# Altium project parallella_schematic.PrjPcb (part 1 of 3)
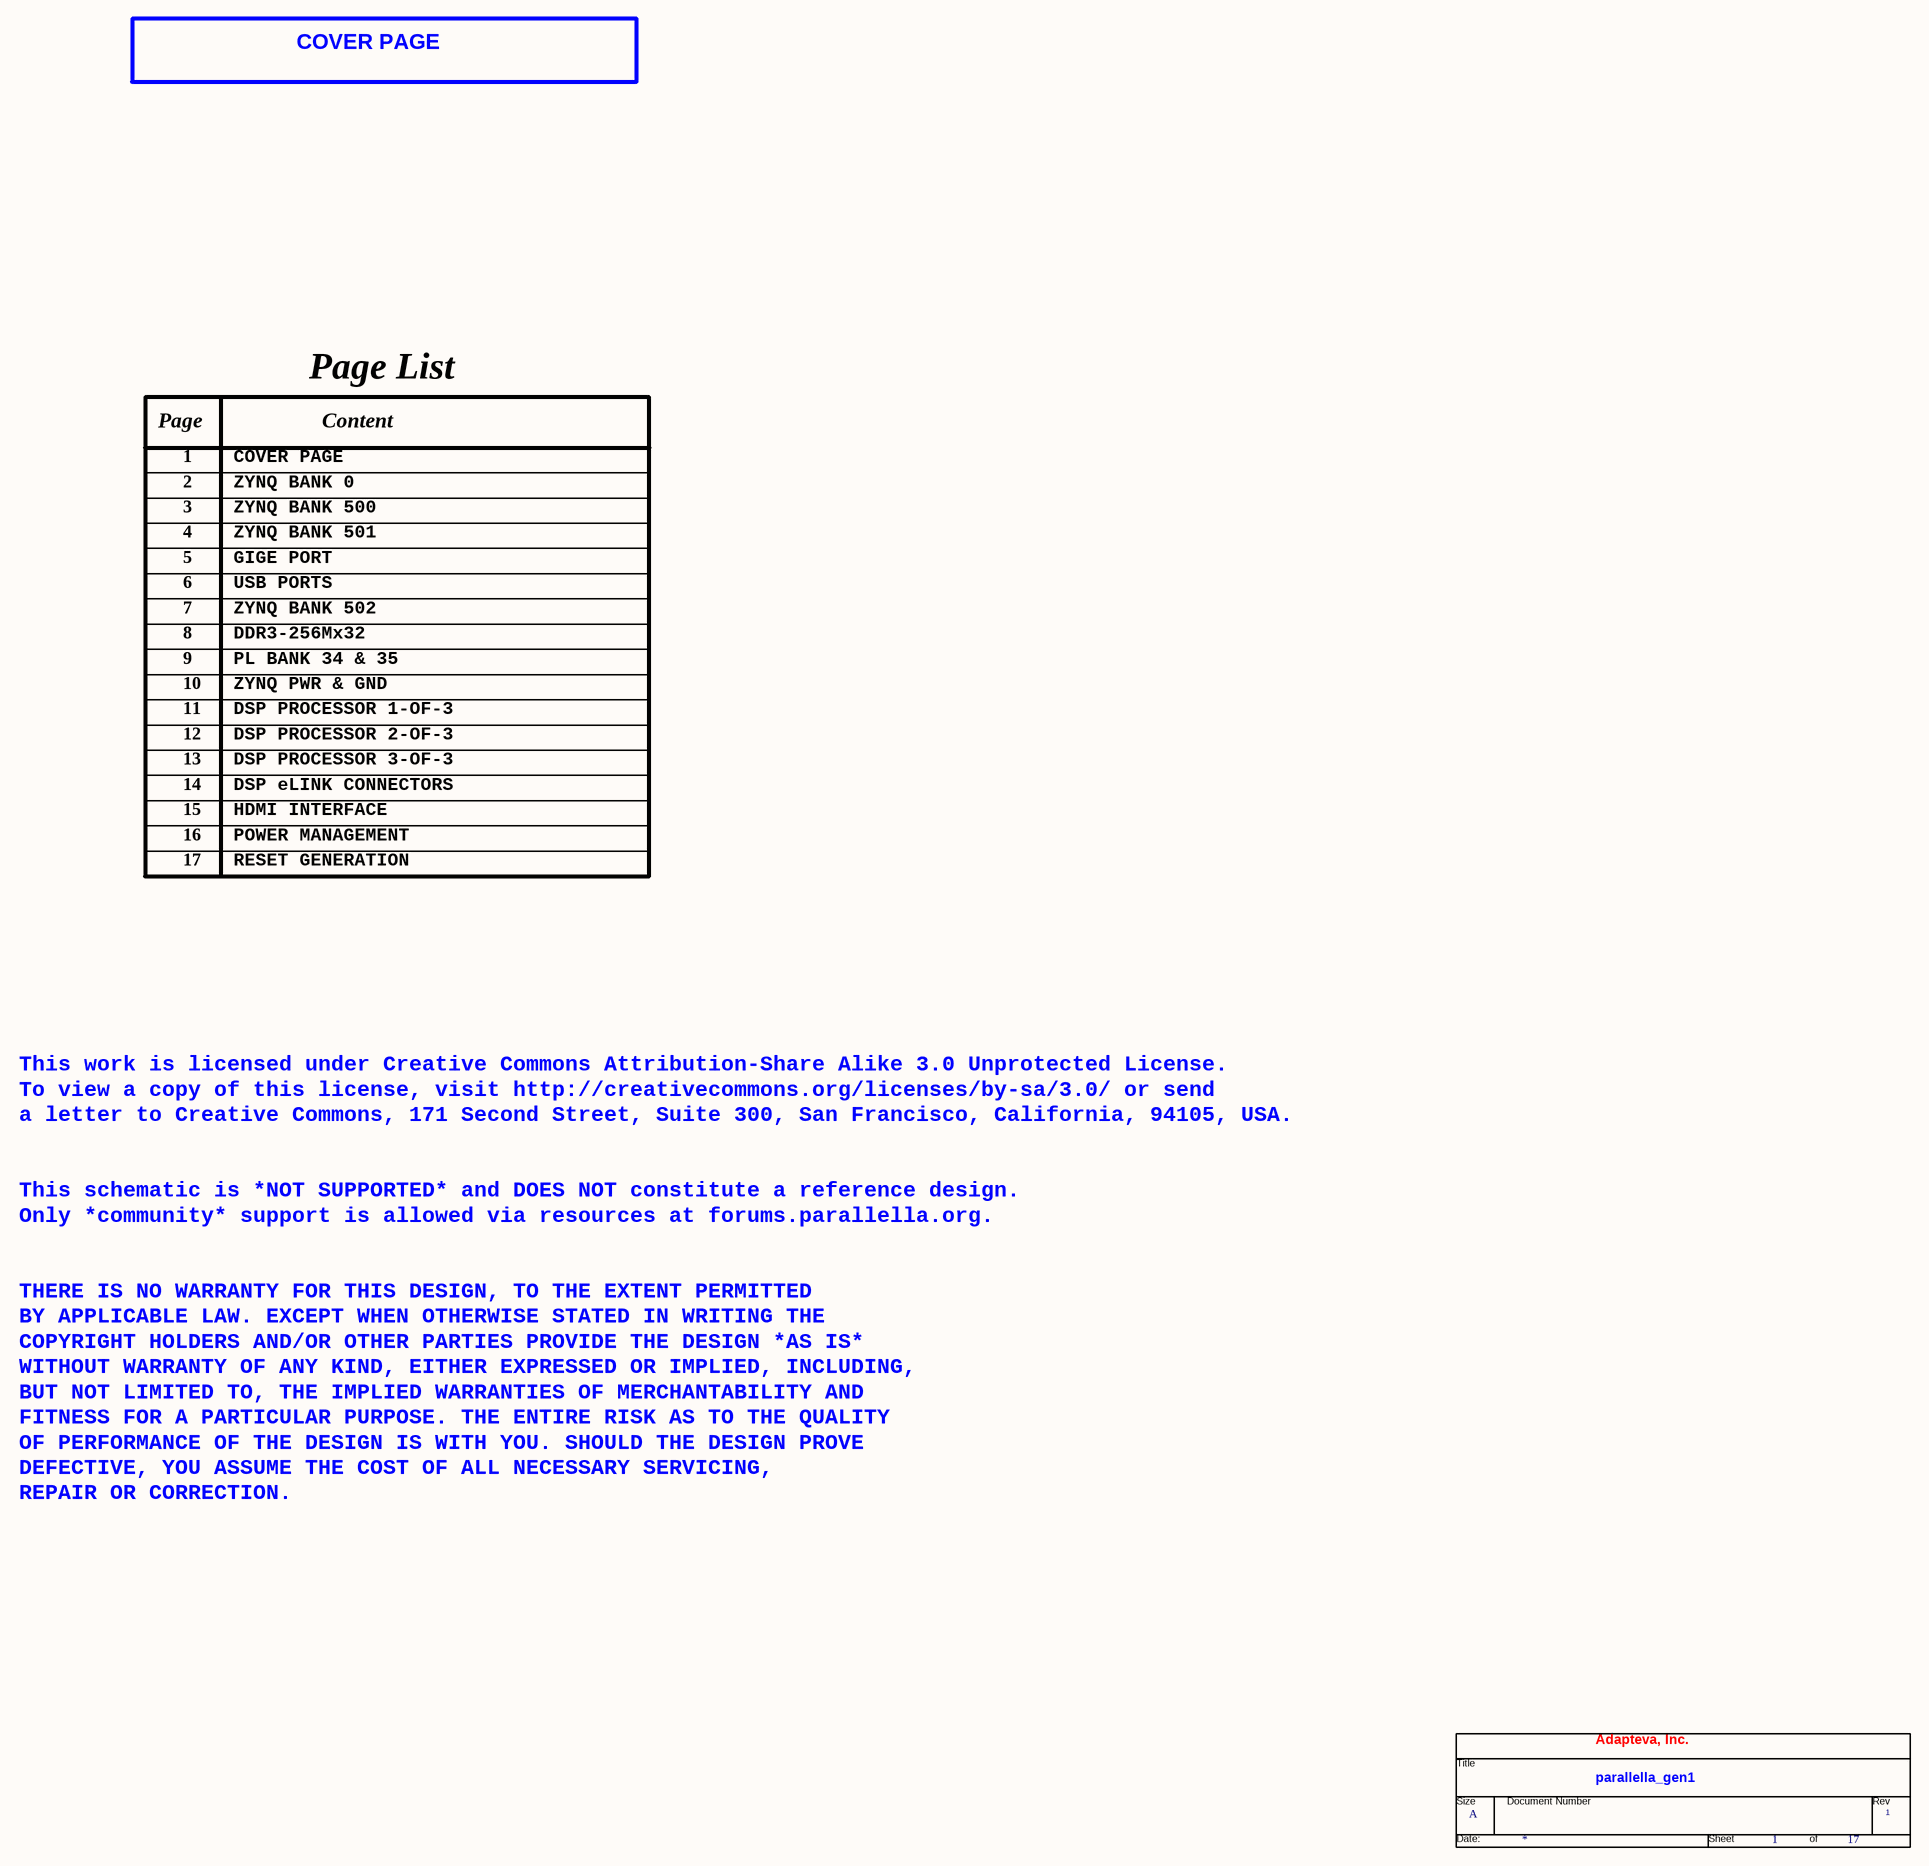
[diagram p0: 01-COVER PAGE.SchDoc]
17 sheets, 569 parts. Net scope: flat (ports and power ports of the same name join across sheets).
Sheets:
  01-COVER PAGE.SchDoc
  02-ZYNQ BANK 0.SchDoc
  03-ZYNQ BANK 500.SchDoc
  04-ZYNQ BANK 501.SchDoc
  05-GIGE PORT.SchDoc
  06-USB PORTS.SchDoc
  07-ZYNQ BANK 502.SchDoc
  08-DDR3-256MX32.SchDoc
  09-PL BANKS 34 & 35.SchDoc
  10-ZYNQ PWR & GND.SchDoc
  11-DSP PROCESSOR 1-OF-3.SchDoc
  12-DSP PROCESSOR 2-OF-3.SchDoc
  13-DSP PROCESSOR 3-OF-3.SchDoc
  14-DSP eLINK CONNECTORS.SchDoc
  15-HDMI TRNSMITTER.SchDoc
  16-POWER MANAGEMENT.SchDoc
  17-RESET GENERATION.SchDoc

## Sheet 01-COVER PAGE.SchDoc
size 513 x 386 mm

### Parts
(Parts that share a designator on the sheet are numbered #1, #2 ... from top to bottom, then left to right.)
*#1  RevCode: 1  Title: parallella_gen1  Page Size: A  Page Count: 17  OrgAddr1: Adapteva, Inc.  (hidden comment: TitleBlock0)  (graphical)

### Notes on the sheet
- COVER PAGE
- Page List
- Page
- 1
- Content
- 3
- 2
- 4
- ZYNQ BANK 501
- ZYNQ BANK 0
- ZYNQ BANK 500
- 5
- 6
- GIGE PORT
- USB PORTS
- 7
- 8
- 9
- DDR3-256Mx32
- ZYNQ BANK 502
- PL BANK 34 & 35
- 10
- 11
- ZYNQ PWR & GND
- DSP PROCESSOR 1-OF-3
- 12
- 13
- 14
- DSP PROCESSOR 2-OF-3
- DSP PROCESSOR 3-OF-3
- DSP eLINK CONNECTORS
- 15
- 16
- HDMI INTERFACE
- POWER MANAGEMENT
- 17
- RESET GENERATION
- This work is licensed under Creative Commons Attribution-Share Alike 3.0 Unprotected License.
- To view a copy of this license, visit http://creativecommons.org/licenses/by-sa/3.0/ or send
- a letter to Creative Commons, 171 Second Street, Suite 300, San Francisco, California, 94105, USA.
- This schematic is *NOT SUPPORTED* and DOES NOT constitute a reference design.
- Only *community* support is allowed via resources at forums.parallella.org.
- THERE IS NO WARRANTY FOR THIS DESIGN, TO THE EXTENT PERMITTED
- BY APPLICABLE LAW. EXCEPT WHEN OTHERWISE STATED IN WRITING THE
- COPYRIGHT HOLDERS AND/OR OTHER PARTIES PROVIDE THE DESIGN *AS IS*
- WITHOUT WARRANTY OF ANY KIND, EITHER EXPRESSED OR IMPLIED, INCLUDING,
- BUT NOT LIMITED TO, THE IMPLIED WARRANTIES OF MERCHANTABILITY AND
- FITNESS FOR A PARTICULAR PURPOSE. THE ENTIRE RISK AS TO THE QUALITY
- OF PERFORMANCE OF THE DESIGN IS WITH YOU. SHOULD THE DESIGN PROVE
- DEFECTIVE, YOU ASSUME THE COST OF ALL NECESSARY SERVICING,
- REPAIR OR CORRECTION.
- (in symbol TitleBlock0) Title; Size; Document Number; Rev; Date:; Sheet; of

### Library data of the parts
*#1 = TitleBlock0: Page Create Date: March  8, 1995; Page Number: 1; Page Modify Date: *

## Sheet 02-ZYNQ BANK 0.SchDoc
size 513 x 386 mm
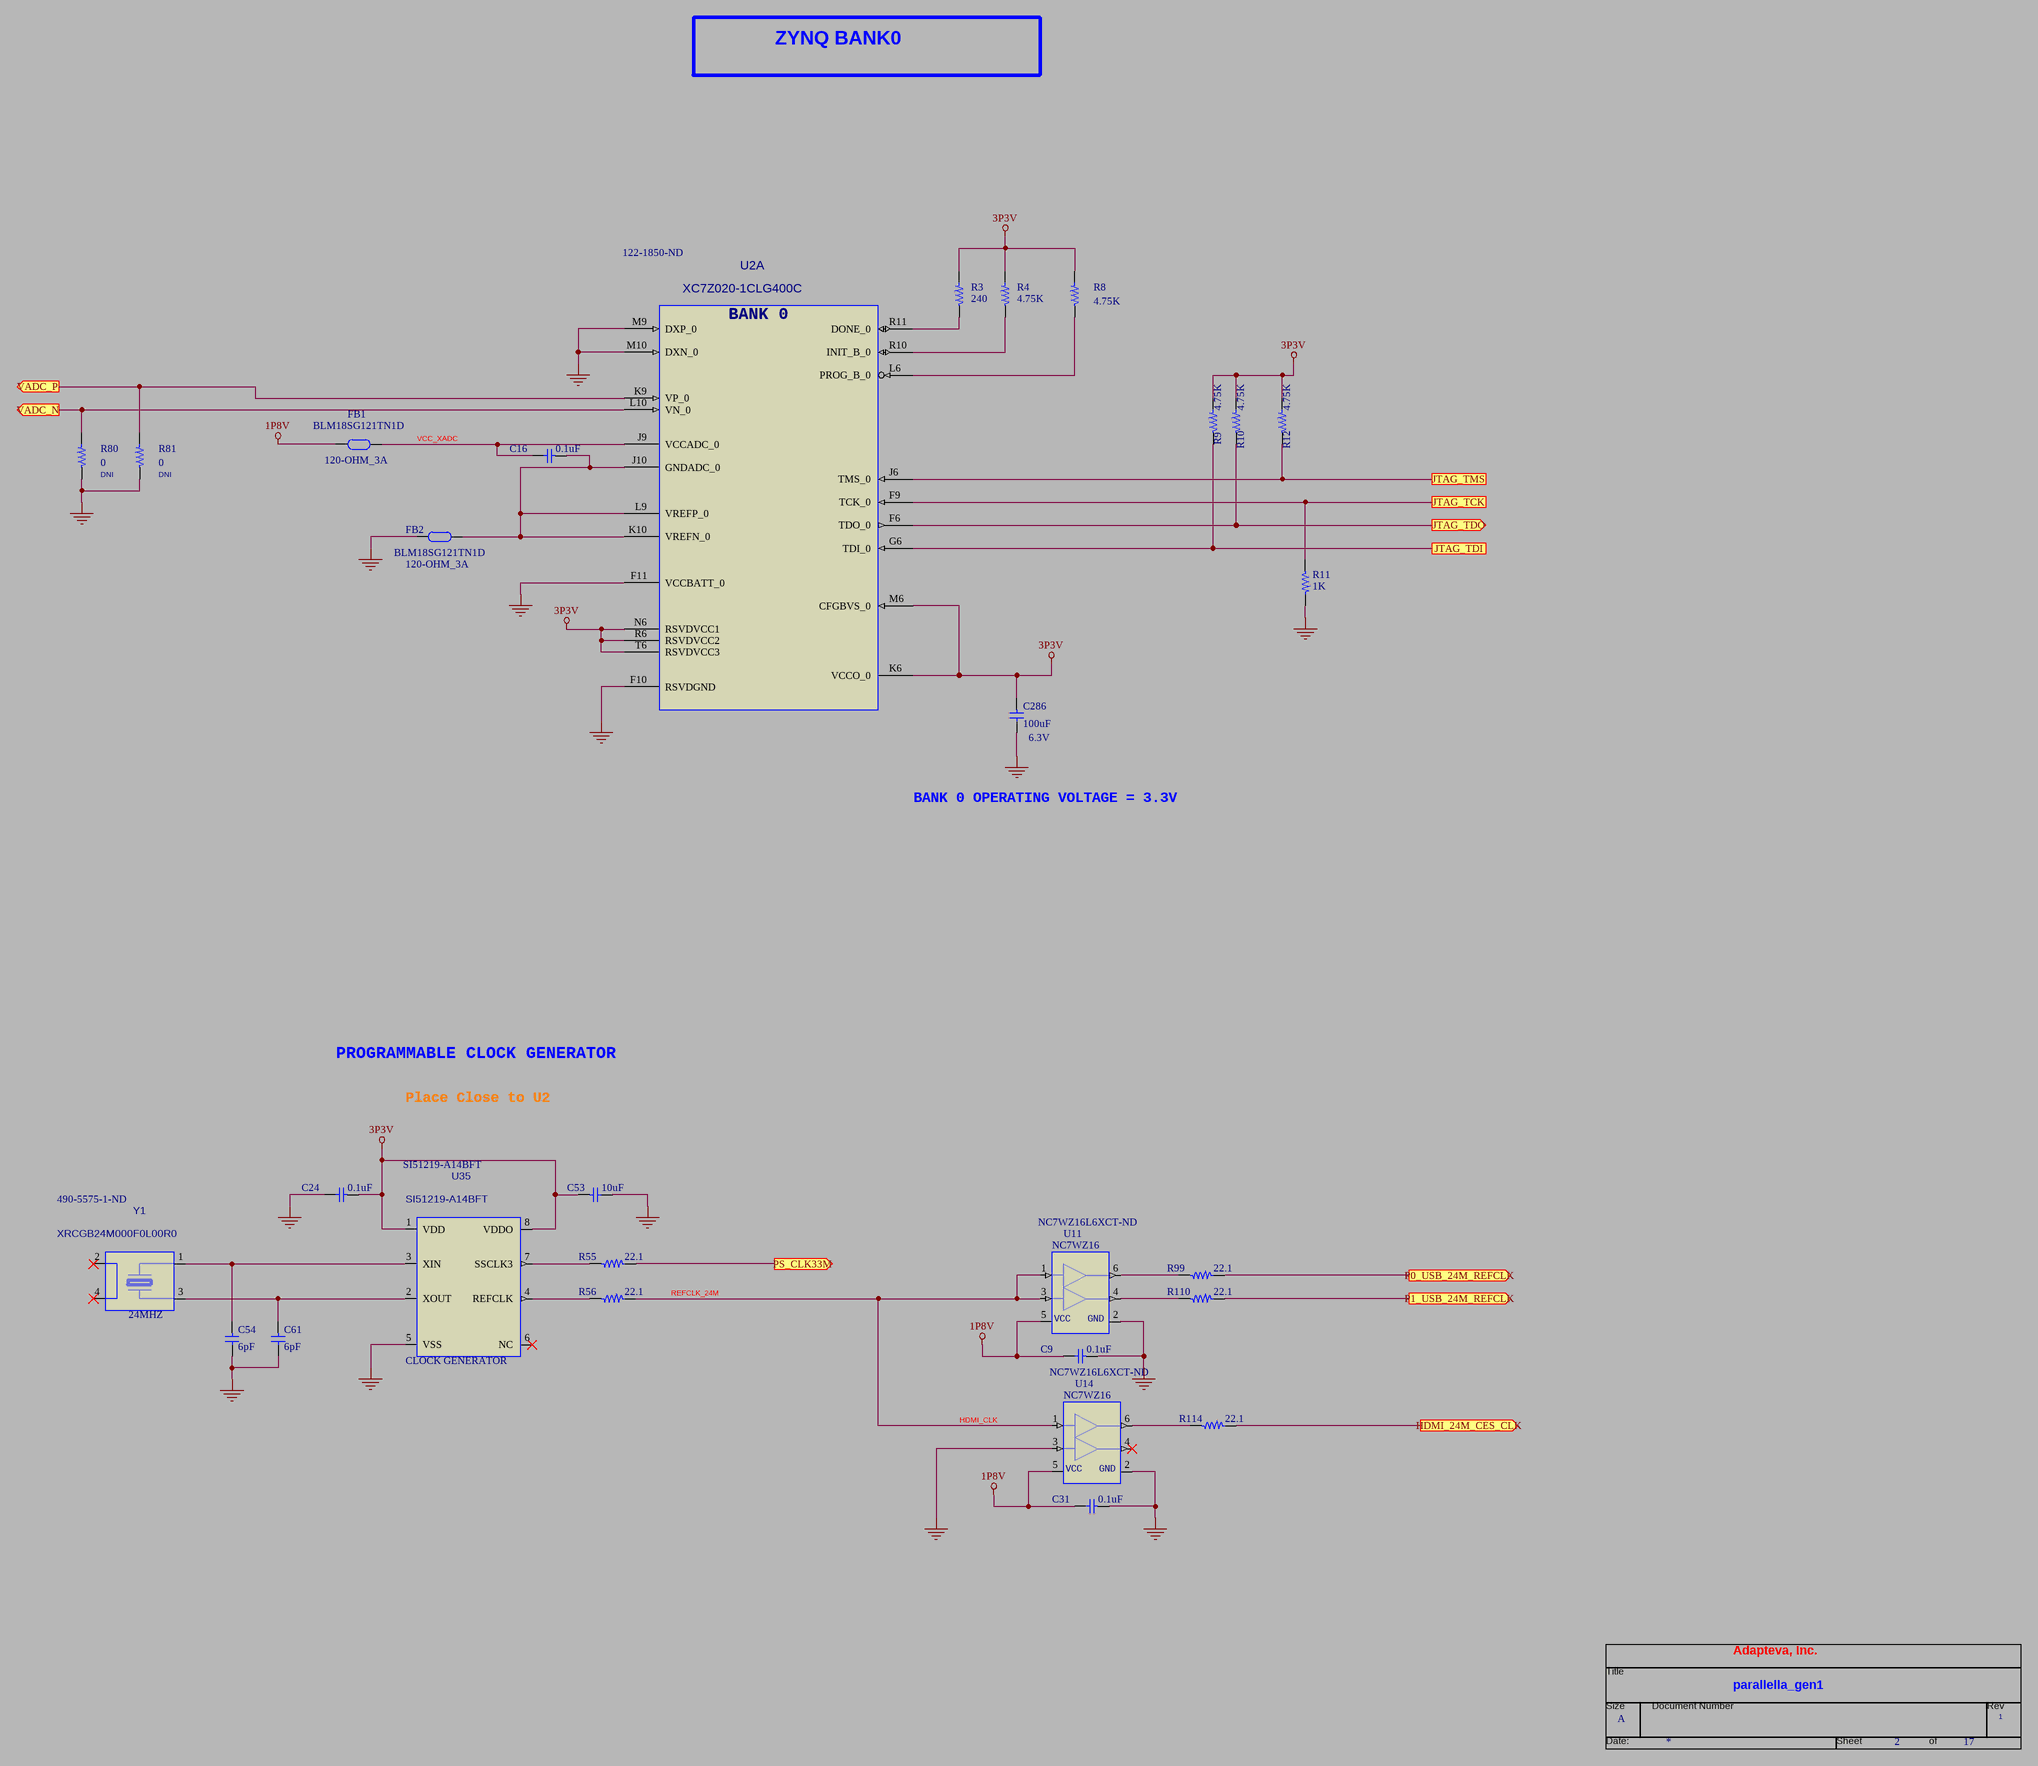
[diagram p1: 02-ZYNQ BANK 0.SchDoc]

### Parts
(Parts that share a designator on the sheet are numbered #1, #2 ... from top to bottom, then left to right.)
*#2  RevCode: 1  Title: parallella_gen1  Page Size: A  Page Number: 2  Page Count: 17  OrgAddr1: Adapteva, Inc.  (hidden comment: TitleBlock0)  (graphical)
C9  0.1uF  [C0402]
C16  0.1uF  [C0402]
C24  0.1uF  [C0402]
C31  0.1uF  [C0402]
C53  10uF  [C0603]
C54  6pF  [C0402]
C61  6pF  [C0402]
C286  100uF  VOLTAGE: 6.3V  [C1210]
FB1  120-OHM_3A  [BEAD_0603]
FB2  120-OHM_3A  [BEAD_0603]
R3  240  [R0402]
R4  4.75K  [R0402]
R8  4.75K  [R0402]
R9  4.75K  [R0402]
R10  4.75K  [R0402]
R11  1K  [R0402]
R12  4.75K  [R0402]
R55  22.1  [R0402]
R56  22.1  [R0402]
R80  0  INSTALL: DNI  [R0402]
R81  0  INSTALL: DNI  [R0402]
R99  22.1  [R0402]
R110  22.1  [R0402]
R114  22.1  [R0402]
U2  Vendor PN: XC7Z020-1CLG400C  Supplier Part Number 1: 122-1850-ND  [CBGA400_17SQ_1P6H_P8MMP]  (hidden comment: 7Z020-CLG400)  (part A of 8)
U11  NC7WZ16  Supplier Part Number 1: NC7WZ16L6XCT-ND  [SC_70_6PSMT]
U14  NC7WZ16  Supplier Part Number 1: NC7WZ16L6XCT-ND  [SC_70_6PSMT]
U35  CLOCK GENERATOR  MFG PART NO: SI51219-A14BFT  [TSSOP8_3X4P4X1P2H_P65MMP]
Y1  24MHZ  Vendor PN: XRCGB24M000F0L00R0  Supplier Part Number 1: 490-5575-1-ND  [OSC4_1P6X2X7MMH]

### Ports
HDMI_24M_CES_CLK (out), JTAG_TCK, JTAG_TDI, JTAG_TDO (out), JTAG_TMS, P0_USB_24M_REFCLK (out), P1_USB_24M_REFCLK (out), PS_CLK33M (out), VADC_N (out), VADC_P (out)

### Nets
1P8V: C9.2 C31.2 FB1.1 U11.5(VCC) U14.5(VCC)
3P3V: C24.1 C53.1 C286.1 R3.2 R4.2 R8.2 R9.2 R10.2 R12.2 U2.K6(VCCO_0) U2.M6(CFGBVS_0) U2.N6(RSVDVCC1) U2.R6(RSVDVCC2) U2.T6(RSVDVCC3) U35.1(VDD) U35.8(VDDO)
GND: C9.1 C24.2 C31.1 C53.2 C54.2 C61.2 C286.2 FB2.1 R11.2 R80.1 R81.1 U2.F10(RSVDGND) U2.F11(VCCBATT_0) U2.M9(DXP_0) U2.M10(DXN_0) U11.2(GND) U14.2(GND) U14.3(A2) U35.5(VSS)  [project net PHY_DIS_REG10]
HDMI_CLK: R56.2 U11.1(A1) U11.3(A2) U14.1(A1)  [also labelled REFCLK_24M]
VCC_XADC: C16.2 FB1.2 U2.J9(VCCADC_0)
NetC16_1: C16.1 FB2.2 U2.J10(GNDADC_0) U2.K10(VREFN_0) U2.L9(VREFP_0)
NetC54_1: C54.1 U35.3(XIN) Y1.1
NetC61_1: C61.1 U35.2(XOUT) Y1.3
NetJ13_33: R80.2 U2.L10(VN_0) ; port VADC_N
NetJ13_34: R81.2 U2.K9(VP_0) ; port VADC_P
NetJ13_37: R12.1 U2.J6(TMS_0) ; port JTAG_TMS
NetJ13_38: R9.1 U2.G6(TDI_0) ; port JTAG_TDI
NetJ13_39: R11.1 U2.F9(TCK_0) ; port JTAG_TCK
NetJ13_40: R10.1 U2.F6(TDO_0) ; port JTAG_TDO
NetR3_1: R3.1 U2.R11(DONE_0)
NetR4_1: R4.1 U2.R10(INIT_B_0)
NetR8_1: R8.1 U2.L6(PROG_B_0)
NetR55_1: R55.1 U35.7(SSCLK3)
NetR55_2: R55.2 ; port PS_CLK33M
NetR56_1: R56.1 U35.4(REFCLK)
NetR99_1: R99.1 U11.6(Y1)
NetR99_2: R99.2 ; port P0_USB_24M_REFCLK
NetR110_1: R110.1 U11.4(Y2)
NetR110_2: R110.2 ; port P1_USB_24M_REFCLK
NetR114_1: R114.1 U14.6(Y1)
NetR114_2: R114.2 ; port HDMI_24M_CES_CLK

Not connected (* = marked no-connect by the designer): U14 4(Y2)*; U35 6(NC)*; Y1 2* 4*

### Notes on the sheet
- ZYNQ BANK0
- BANK 0 OPERATING VOLTAGE = 3.3V
- PROGRAMMABLE CLOCK GENERATOR
- Place Close to U2
- (in symbol TitleBlock0) Title; Size; Document Number; Rev; Date:; Sheet; of
- (in symbol ZYNQ_7Z020_CLG400, part A) BANK 0

### Library data of the parts
C9 C16 C24 C31 = CAP0402_0P1UF_X5R_35V: CAP, 0402, 0.1UF, X5R, 35V; ALT_SYMBOLS: C0402_BGA; Vendor PN: GMK105BJ104KV-F; Vendor: TAIYO YUDEN; DEVICE: CAP0402_0P1UF_X5R_35V; MFG PART NO: GMK105BJ104KV-F; MFG: TAIYO YUDEN; PCB Footprint: C0402
C53 = CAP0603_10UF_X5R: CAP, 0603, 10UF, X5R, 10V; MFG PART NO: LMK107BJ106MALTD; MFG: TAIYO YUDEN; DEVICE: CAP0603_10UF_X5R; Vendor: TAIYO YUDEN; Vendor PN: LMK107BJ106MALTD; PCB Footprint: C0603
C54 C61 = CAP0402_6PF_NPO_50V: CAP, 0402, 6PF, NPO, 50V; ALT_SYMBOLS: C0402_BGA; Vendor PN: C1005COG1H060D050BA; Vendor: TDK; DEVICE: CAP0402_6PF_NPO_50V; MFG PART NO: C1005COG1H060D050BA; MFG: TDK; PCB Footprint: C0402
C286 = CAP1210_100UF_X5R_LOESR: CAP, 1210, 100UF, X5R, 6.3V, LOW ESR; MFG PART NO: GRM32ER60J107ME20L; MFG: MURATA; DEVICE: CAP1210_100UF_X5R_LOESR; Vendor: MURATA; Vendor PN: GRM32ER60J107ME20L; PCB Footprint: C1210
FB1 FB2 = BLM18SG121TN1D: FERRITE, BEAD, FILTER, 0603, 3A; Vendor: MURATA; PCB Footprint: FB0603; Vendor PN: BLM18SG121TN1D; DEVICE: BLM18SG121TN1D
R3 = RES0402_240: RES, 0402, 240, 1%; MFG PART NO: CRCW0402240RFKED; ALT_SYMBOLS: R0402_BGA; MFG: VISHAY; Vendor: VISHAY/DALE; DEVICE: RES0402_240; Vendor PN: CRCW0402240RFKED; PCB Footprint: R0402
R4 R8-R10 R12 = RES0402_4K75: RES, 0402, 4.75K, 1%; MFG PART NO: CRCW04024K75FKED; MFG: VISHAY; Vendor: VISHAY/DALE; ALT_SYMBOLS: R0402_BGA; DEVICE: RES0402_4K75; Vendor PN: CRCW04024K75FKED; PCB Footprint: R0402
R11 = RES0402_1K: RES, 0402, 1K; MFG PART NO: CRCW04021K00FKED; ALT_SYMBOLS: R0402_BGA; MFG: VISHAY; Vendor: VISHAY/DALE; DEVICE: RES0402_1K; Vendor PN: CRCW04021K00FKED; PCB Footprint: R0402
R55 R56 R99 R110 R114 = RES0402_22R1: RES, 0402, 22.1, 1%; MFG PART NO: CRCW040222R1FKED; MFG: VISHAY; Vendor: VISHAY/DALE; ALT_SYMBOLS: R0402_BGA; DEVICE: RES0402_22R1; Vendor PN: CRCW040222R1FKED; PCB Footprint: R0402
R80 R81 = RES0402_0: RES, 0402, 0 OHM, 1%; MFG PART NO: CRCW04020000Z0ED; ALT_SYMBOLS: R0402_BGA; MFG: VISHAY; Vendor: VISHAY/DALE; DEVICE: RES0402_0; Vendor PN: CRCW04020000Z0ED; PCB Footprint: R0402
U2 = ZYNQ_7Z020_CLG400: IC, EPP, XILINX, ZYNQ, 7Z020, CLG400; SPLIT_INST: TRUE; Vendor: XILINX; DEVICE: ZYNQ_7Z020_CLG400; PCB Footprint: CBGA400_17SQ_1P6H_P8MMP; Supplier 1: Digi-Key
U11 U14 = NC7WZ16: MFG PART NO: NC7WZ16P6X; MFG: FAIRCHILD; DEVICE: NC7WZ16; Vendor: FAIRCHILD; Vendor PN: NC7WZ16P6X; PCB Footprint: SC_70_6PSMT; Supplier 1: Digi-Key
U35 = IC_SI51219: IC, PROGRAMMABLE CLOCK GEN, 3 OUTPUTS, TSSOP8; MFG: SILICON LABS; Vendor: SILICON LABS; Vendor PN: SI51219-A14BFT; PCB Footprint: TSSOP8_3X4P4X1P2H_P65MMP; Supplier 1: Avnet; Supplier Part Number 1: SI51219-A14BFT
Y1 = CRYSTAL_4P_24MHZ: XTAL, 2X1.6MM, 24MHZ, 4PIN, SMT; Vendor: MURATA; DEVICE: CRYSTAL_4P_24MHZ; PCB Footprint: OSC4_1P6X2X7MMH; Supplier 1: Digi-Key
*#2 = TitleBlock0: Page Create Date: March  8, 1995; Page Modify Date: *

## Sheet 03-ZYNQ BANK 500.SchDoc
size 513 x 386 mm
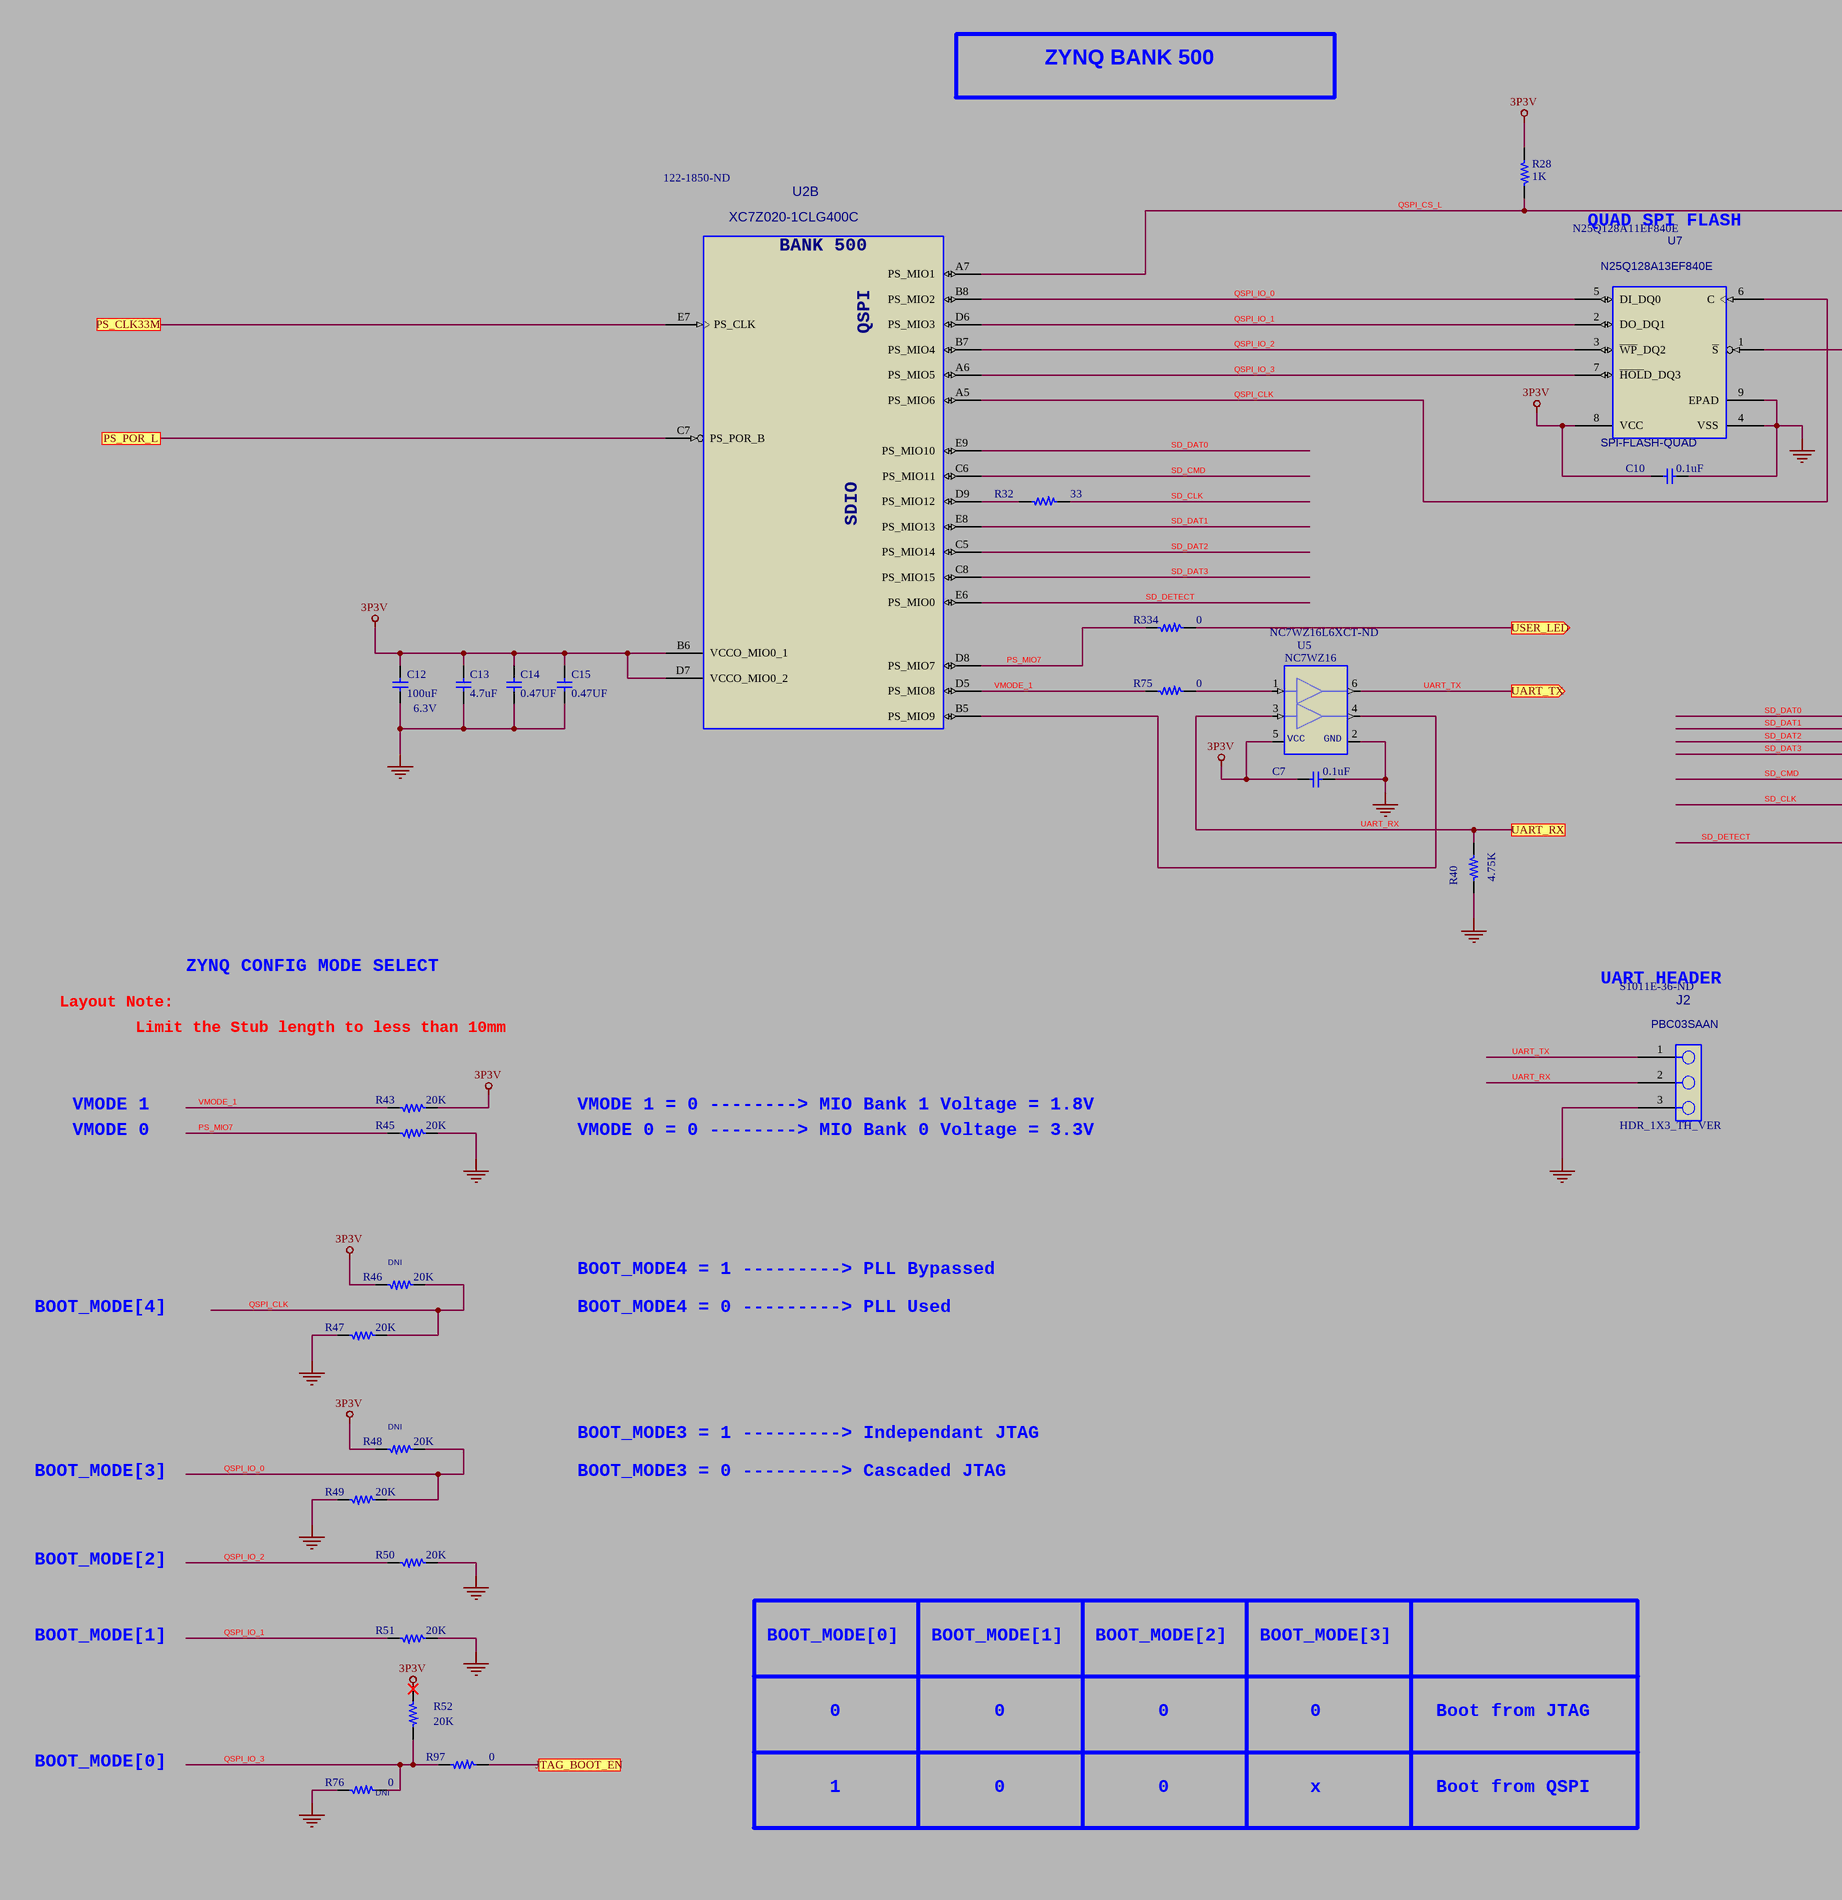
[diagram p2: 03-ZYNQ BANK 500.SchDoc, left]
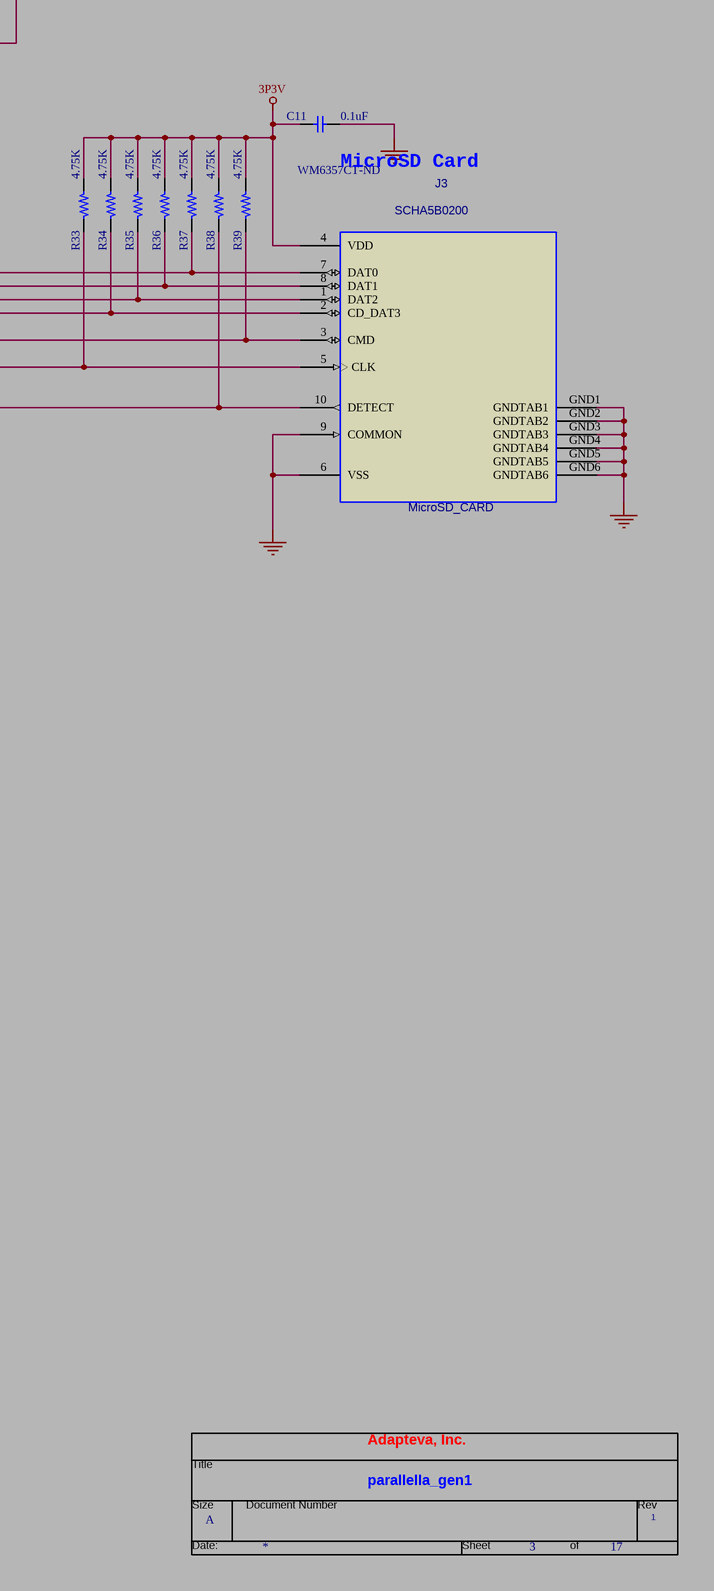
[diagram p3: 03-ZYNQ BANK 500.SchDoc, right]

### Parts
(Parts that share a designator on the sheet are numbered #1, #2 ... from top to bottom, then left to right.)
*#3  RevCode: 1  Title: parallella_gen1  Page Size: A  Page Number: 3  Page Count: 17  OrgAddr1: Adapteva, Inc.  (hidden comment: TitleBlock0)  (graphical)
C7  0.1uF  [C0402]
C10  0.1uF  [C0402]
C11  0.1uF  [C0402]
C12  100uF  VOLTAGE: 6.3V  [C1210]
C13  4.7uF  [C0402]
C14  0.47UF  [C0402]
C15  0.47UF  [C0402]
J2  HDR_1X3_TH_VER  Vendor PN: PBC03SAAN  Supplier Part Number 1: S1011E-36-ND  [HDR_1X3_TH_VER]
J3  MicroSD_CARD  Vendor PN: SCHA5B0200  Supplier Part Number 1: WM6357CT-ND  [SDMICRO_8PIN_REV_15SQX1P51MMH]
R28  1K  [R0402]
R32  33  [R0402]
R33  4.75K  [R0402]
R34  4.75K  [R0402]
R35  4.75K  [R0402]
R36  4.75K  [R0402]
R37  4.75K  [R0402]
R38  4.75K  [R0402]
R39  4.75K  [R0402]
R40  4.75K  [R0402]
R43  20K  [R0402]
R45  20K  [R0402]
R46  20K  INSTALL: DNI  [R0402]
R47  20K  [R0402]
R48  20K  INSTALL: DNI  [R0402]
R49  20K  [R0402]
R50  20K  [R0402]
R51  20K  [R0402]
R52  20K  [R0402]
R75  0  [R0402]
R76  0  INSTALL: DNI  [R0402]
R97  0  [R0402]
R334  0  [R0402]
U2  Vendor PN: XC7Z020-1CLG400C  Supplier Part Number 1: 122-1850-ND  [CBGA400_17SQ_1P6H_P8MMP]  (hidden comment: 7Z020-CLG400)  (part B of 8)
U5  NC7WZ16  Supplier Part Number 1: NC7WZ16L6XCT-ND  [SC_70_6PSMT]
U7  SPI-FLASH-QUAD  Vendor PN: N25Q128A13EF840E  Supplier Part Number 1: N25Q128A11EF840E  [VPDFN-8_6X8XP85H_1P27MMP]

### Ports
JTAG_BOOT_EN, PS_CLK33M, PS_POR_L, UART_RX, UART_TX (out), USER_LED (out)

### Nets
3P3V: C7.2 C10.2 C11.2 C12.1 C13.1 C14.1 C15.1 J3.4(VDD) R28.1 R33.2 R34.2 R35.2 R36.2 R37.2 R38.2 R39.2 R43.1 R46.2 R48.2 R52.1 U2.B6(VCCO_MIO0_1) U2.D7(VCCO_MIO0_2) U5.5(VCC) U7.8(VCC)
GND: C7.1 C10.1 C11.1 C12.2 C13.2 C14.2 C15.2 J2.3 J3.6(VSS) J3.9(COMMON) J3.GND1(GNDTAB1) J3.GND2(GNDTAB2) J3.GND3(GNDTAB3) J3.GND4(GNDTAB4) J3.GND5(GNDTAB5) J3.GND6(GNDTAB6) R40.1 R45.1 R47.2 R49.2 R50.1 R51.1 R76.1 U5.2(GND) U7.4(VSS) U7.9(EPAD)  [project net PHY_DIS_REG10]
PS_MIO7: R45.2 R334.1 U2.D8(PS_MIO7)
QSPI_CLK: R46.1 R47.1 U2.A5(PS_MIO6) U7.6(C)
QSPI_CS_L: R28.2 U2.A7(PS_MIO1) U7.1(~{S})
QSPI_IO_0: R48.1 R49.1 U2.B8(PS_MIO2) U7.5(DI_DQ0)
QSPI_IO_1: R51.2 U2.D6(PS_MIO3) U7.2(DO_DQ1)
QSPI_IO_2: R50.2 U2.B7(PS_MIO4) U7.3(~{WP}_DQ2)
QSPI_IO_3: R52.2 R76.2 R97.1 U2.A6(PS_MIO5) U7.7(~{HOL}D_DQ3)
SD_CLK: J3.5(CLK) R32.2 R33.1
SD_CMD: J3.3(CMD) R39.1 U2.C6(PS_MIO11)
SD_DAT0: J3.7(DAT0) R37.1 U2.E9(PS_MIO10)
SD_DAT1: J3.8(DAT1) R36.1 U2.E8(PS_MIO13)
SD_DAT2: J3.1(DAT2) R35.1 U2.C5(PS_MIO14)
SD_DAT3: J3.2(CD_DAT3) R34.1 U2.C8(PS_MIO15)
SD_DETECT: J3.10(DETECT) R38.1 U2.E6(PS_MIO0)
UART_RX: J2.2 R40.2 U5.3(A2) ; port UART_RX
UART_TX: J2.1 U5.6(Y1) ; port UART_TX
VMODE_1: R43.2 R75.1 U2.D5(PS_MIO8)
NetCR10_2: R334.2 ; port USER_LED
NetJ13_29: R97.2 ; port JTAG_BOOT_EN
NetR32_1: R32.1 U2.D9(PS_MIO12)
NetR55_2: U2.E7(PS_CLK) ; port PS_CLK33M
NetR75_2: R75.2 U5.1(A1)
NetR95_2: U2.C7(PS_POR_B) ; port PS_POR_L
NetU2_B5: U2.B5(PS_MIO9) U5.4(Y2)

### Notes on the sheet
- ZYNQ BANK 500
- QUAD SPI FLASH
- (near C11) MicroSD Card
- ZYNQ CONFIG MODE SELECT
- UART HEADER
- Layout Note:
- Limit the Stub length to less than 10mm
- VMODE 1
- VMODE 1 = 0 --------> MIO Bank 1 Voltage = 1.8V
- VMODE 0
- VMODE 0 = 0 --------> MIO Bank 0 Voltage = 3.3V
- BOOT_MODE4 = 1 ---------> PLL Bypassed
- BOOT_MODE[4]
- BOOT_MODE4 = 0 ---------> PLL Used
- BOOT_MODE[3]
- BOOT_MODE3 = 1 ---------> Independant JTAG
- BOOT_MODE3 = 0 ---------> Cascaded JTAG
- BOOT_MODE[2]
- BOOT_MODE[1]
- BOOT_MODE[0]
- 0
- Boot from JTAG
- 1
- x
- Boot from QSPI
- (in symbol TitleBlock0) Title; Size; Document Number; Rev; Date:; Sheet; of
- (in symbol ZYNQ_7Z020_CLG400, part B) BANK 500; QSPI; SDIO

### Library data of the parts
C7 C10 C11 = CAP0402_0P1UF_X5R_35V: as C9 on sheet 02-ZYNQ BANK 0; DEVICE: CAP0402_0P1UF_X5R_35V; MFG PART NO: GMK105BJ104KV-F; MFG: TAIYO YUDEN; PCB Footprint: C0402
C12 = CAP1210_100UF_X5R_LOESR: as C286 on sheet 02-ZYNQ BANK 0; DEVICE: CAP1210_100UF_X5R_LOESR; Vendor: MURATA; Vendor PN: GRM32ER60J107ME20L; PCB Footprint: C1210
C13 = CAP0402_4P7UF_X5R: CAP, 0402, 4.7UF, X5R, 6.3V; MFG PART NO: C1005X5R0J475K; MFG: TDK; ALT_SYMBOLS: C0402_BGA; DEVICE: CAP0402_4P7UF_X5R; Vendor: TDK; Vendor PN: C1005X5R0J475K; PCB Footprint: C0402
C14 C15 = CAP0402_0P47UF_X5R: CAP, 0402, 0.47UF, X5R, 16V; MFG PART NO: C1005X5R1C474K; MFG: TDK; ALT_SYMBOLS: C0402_BGA; DEVICE: CAP0402_0P47UF_X5R; Vendor: TDK; Vendor PN: C1005X5R1C474K; PCB Footprint: C0402
J2 = HDR_1X3_TH_VER_0.1P: HDR, 1ROW, 3POS, VERT, TH, 1X3, 0.100 PITCH; MFG PART NO: PBC36SAAN; Vendor: SULLINS; MFG: SULLINS; DEVICE: HDR_1X3_TH_VER_0.1P; PCB Footprint: HDR_1X3_TH_VER; Supplier 1: Digi-Key
J3 = CONN_MICROSD_CARD: CONN, MICRO SD CARD, PUSH-PUSH; Vendor: ALPS; DEVICE: CONN_MICROSD_CARD; MFG_PN: SCHA5B0200; MFG: ALPS; PCB Footprint: SDMICRO_8PIN_REV_15SQX1P51MMH; Supplier 1: Digi-Key
R28 = RES0402_1K: as R11 on sheet 02-ZYNQ BANK 0; DEVICE: RES0402_1K; Vendor PN: CRCW04021K00FKED; PCB Footprint: R0402
R32 = RES0402_33: RES, 0402, 33, 1%; MFG PART NO: CRCW040233R0FKED; MFG: VISHAY; Vendor: VISHAY/DALE; ALT_SYMBOLS: R0402_BGA; DEVICE: RES0402_33; Vendor PN: CRCW040233R0FKED; PCB Footprint: R0402
R33-R40 = RES0402_4K75: as R4 on sheet 02-ZYNQ BANK 0; DEVICE: RES0402_4K75; Vendor PN: CRCW04024K75FKED; PCB Footprint: R0402
R43 R45-R52 = RES0402_20K: RES, 0402, 20K; Vendor PN: CRCW040220K0FKED; Vendor: VISHAY/DALE; MFG: VISHAY; ALT_SYMBOLS: R0402_BGA; MFG PART NO: CRCW040220K0FKED; DEVICE: RES0402_20K; PCB Footprint: R0402
R75 R76 R97 R334 = RES0402_0: as R80 on sheet 02-ZYNQ BANK 0; DEVICE: RES0402_0; Vendor PN: CRCW04020000Z0ED; PCB Footprint: R0402
U2 = ZYNQ_7Z020_CLG400: as U2 on sheet 02-ZYNQ BANK 0; Vendor: XILINX; DEVICE: ZYNQ_7Z020_CLG400; PCB Footprint: CBGA400_17SQ_1P6H_P8MMP; Supplier 1: Digi-Key
U5 = NC7WZ16: MFG PART NO: NC7WZ16P6X; MFG: FAIRCHILD; DEVICE: NC7WZ16; Vendor: FAIRCHILD; Vendor PN: NC7WZ16P6X; PCB Footprint: SC_70_6PSMT; Supplier 1: Digi-Key
U7 = IC_SPI_FLASH_QUAD_128Mb: SPI FLASH, QUAD, 128M-BIT, VPDFN8, 1.8V; MFG: MICRON; MFG PART NO: N25Q128A11EF840E; Vendor: MICRON; DEVICE: IC_SPI_FLASH_QUAD_128Mb; PCB Footprint: VPDFN-8_6X8XP85H_1P27MMP; Supplier 1: Arrow
*#3 = TitleBlock0: Page Create Date: March  8, 1995; Page Modify Date: *

## Sheet 04-ZYNQ BANK 501.SchDoc
size 513 x 386 mm
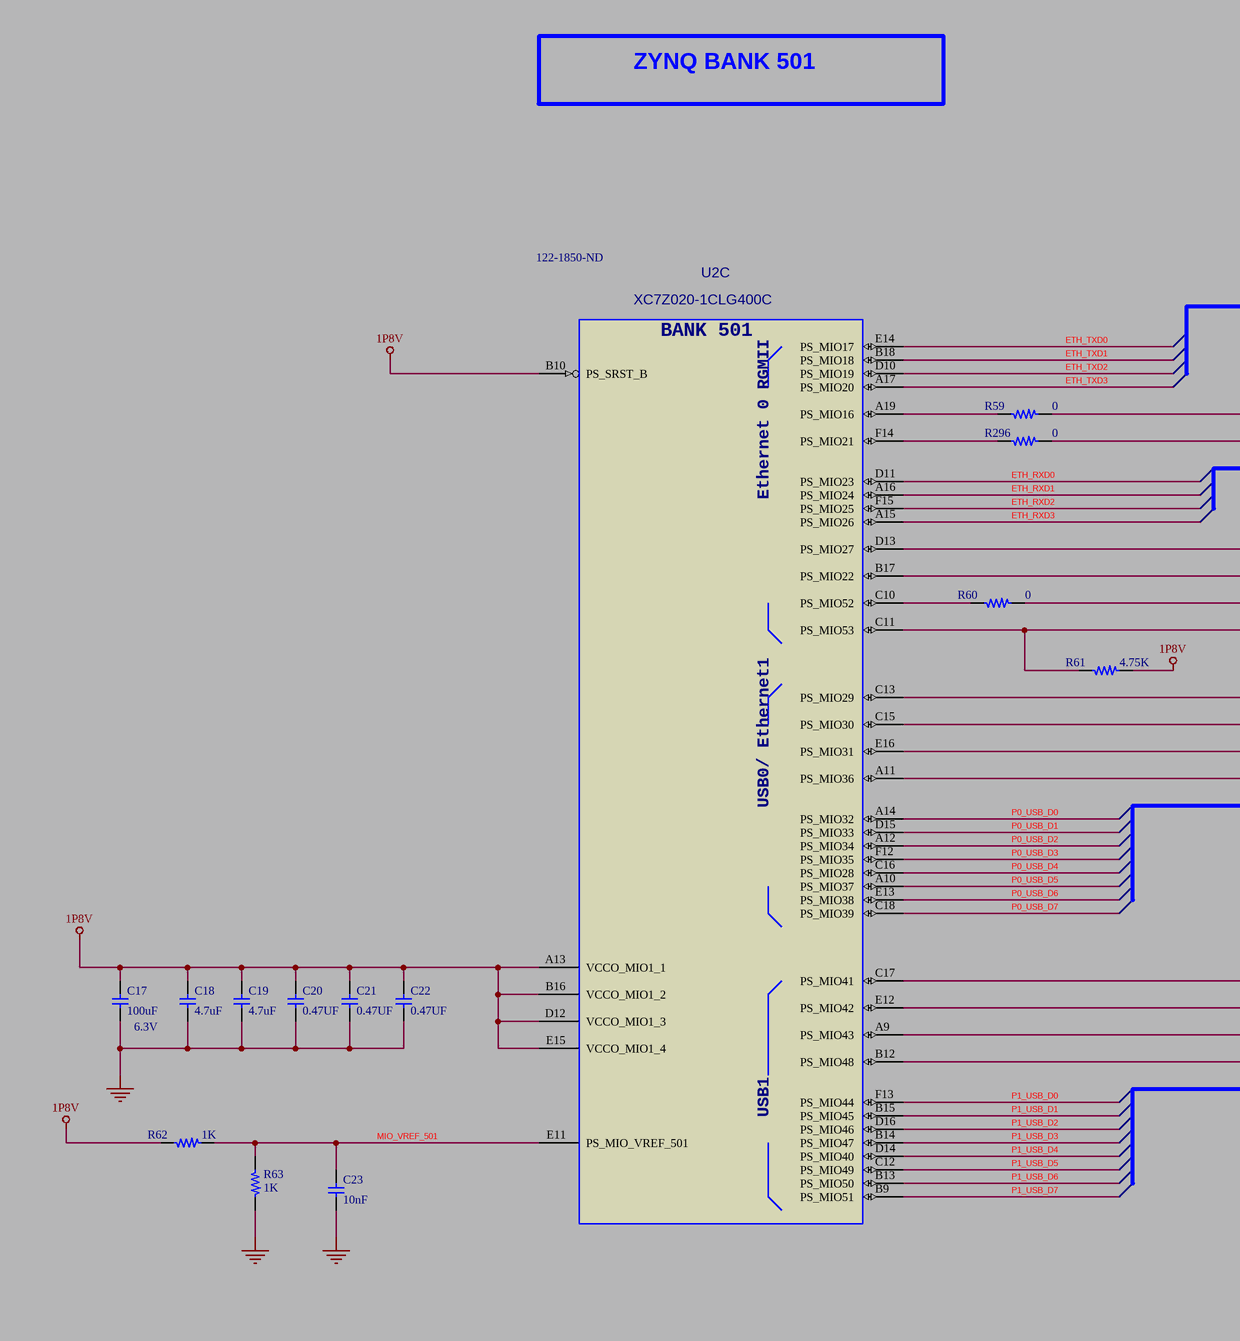
[diagram p4: 04-ZYNQ BANK 501.SchDoc, left]
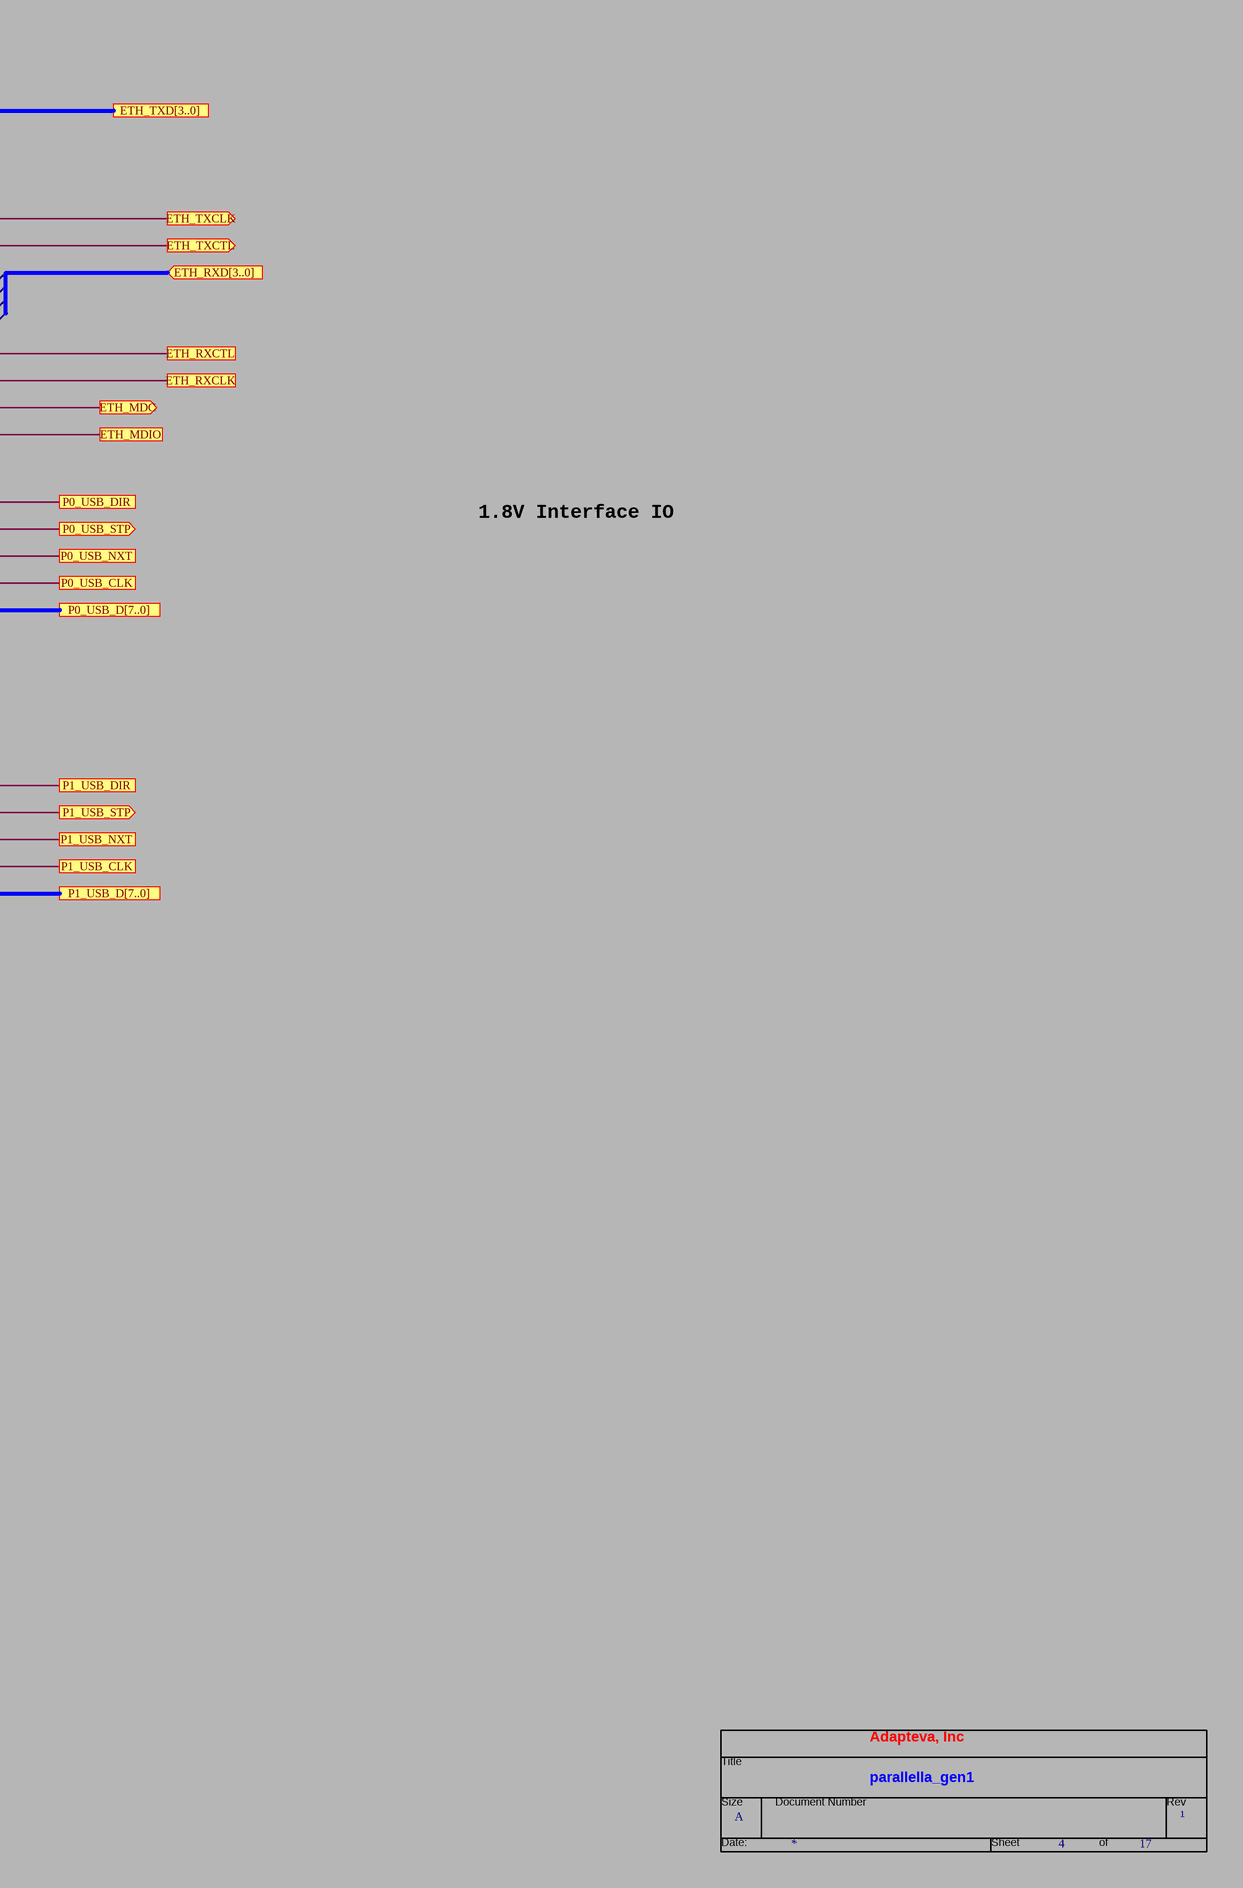
[diagram p5: 04-ZYNQ BANK 501.SchDoc, right]

### Parts
(Parts that share a designator on the sheet are numbered #1, #2 ... from top to bottom, then left to right.)
*#4  RevCode: 1  Title: parallella_gen1  Page Size: A  Page Number: 4  Page Count: 17  OrgAddr1: Adapteva, Inc  (hidden comment: TitleBlock0)  (graphical)
C17  100uF  VOLTAGE: 6.3V  [C1210]
C18  4.7uF  [C0402]
C19  4.7uF  [C0402]
C20  0.47UF  [C0402]
C21  0.47UF  [C0402]
C22  0.47UF  [C0402]
C23  10nF  [C0402]
R59  0  [R0402]
R60  0  [R0402]
R61  4.75K  [R0402]
R62  1K  [R0402]
R63  1K  [R0402]
R296  0  [R0402]
U2  Vendor PN: XC7Z020-1CLG400C  Supplier Part Number 1: 122-1850-ND  [CBGA400_17SQ_1P6H_P8MMP]  (hidden comment: 7Z020-CLG400)  (part C of 8)

### Ports
ETH_MDC (out), ETH_MDIO, ETH_RXCLK, ETH_RXCTL, ETH_RXD[3..0] (in), ETH_TXCLK (out), ETH_TXCTL (out), ETH_TXD[3..0], P0_USB_CLK, P0_USB_D[7..0], P0_USB_DIR, P0_USB_NXT, P0_USB_STP (out), P1_USB_CLK, P1_USB_D[7..0], P1_USB_DIR, P1_USB_NXT, P1_USB_STP (out)

### Nets
1P8V: C17.1 C18.1 C19.1 C20.1 C21.1 C22.1 R61.2 R62.1 U2.A13(VCCO_MIO1_1) U2.B10(PS_SRST_B) U2.B16(VCCO_MIO1_2) U2.D12(VCCO_MIO1_3) U2.E15(VCCO_MIO1_4)
GND: C17.2 C18.2 C19.2 C20.2 C21.2 C22.2 C23.2 R63.2  [project net PHY_DIS_REG10]
ETH_RXD0: U2.D11(PS_MIO23)
ETH_RXD1: U2.A16(PS_MIO24)
ETH_RXD2: U2.F15(PS_MIO25)
ETH_RXD3: U2.A15(PS_MIO26)
ETH_TXD0: U2.E14(PS_MIO17)
ETH_TXD1: U2.B18(PS_MIO18)
ETH_TXD2: U2.D10(PS_MIO19)
ETH_TXD3: U2.A17(PS_MIO20)
MIO_VREF_501: C23.1 R62.2 R63.1 U2.E11(PS_MIO_VREF_501)
P0_USB_D0: U2.A14(PS_MIO32)
P0_USB_D1: U2.D15(PS_MIO33)
P0_USB_D2: U2.A12(PS_MIO34)
P0_USB_D3: U2.F12(PS_MIO35)
P0_USB_D4: U2.C16(PS_MIO28)
P0_USB_D5: U2.A10(PS_MIO37)
P0_USB_D6: U2.E13(PS_MIO38)
P0_USB_D7: U2.C18(PS_MIO39)
P1_USB_D0: U2.F13(PS_MIO44)
P1_USB_D1: U2.B15(PS_MIO45)
P1_USB_D2: U2.D16(PS_MIO46)
P1_USB_D3: U2.B14(PS_MIO47)
P1_USB_D4: U2.D14(PS_MIO40)
P1_USB_D5: U2.C12(PS_MIO49)
P1_USB_D6: U2.B13(PS_MIO50)
P1_USB_D7: U2.B9(PS_MIO51)
NetR59_1: R59.1 U2.A19(PS_MIO16)
NetR59_2: R59.2 ; port ETH_TXCLK
NetR60_1: R60.1 U2.C10(PS_MIO52)
NetR60_2: R60.2 ; port ETH_MDC
NetR61_1: R61.1 U2.C11(PS_MIO53) ; port ETH_MDIO
NetR71_1: U2.B17(PS_MIO22) ; port ETH_RXCLK
NetR296_1: R296.1 U2.F14(PS_MIO21)
NetR296_2: R296.2 ; port ETH_TXCTL
NetR297_1: U2.D13(PS_MIO27) ; port ETH_RXCTL
NetU2_A9: U2.A9(PS_MIO43) ; port P1_USB_NXT
NetU2_A11: U2.A11(PS_MIO36) ; port P0_USB_CLK
NetU2_B12: U2.B12(PS_MIO48) ; port P1_USB_CLK
NetU2_C13: U2.C13(PS_MIO29) ; port P0_USB_DIR
NetU2_C15: U2.C15(PS_MIO30) ; port P0_USB_STP
NetU2_C17: U2.C17(PS_MIO41) ; port P1_USB_DIR
NetU2_E12: U2.E12(PS_MIO42) ; port P1_USB_STP
NetU2_E16: U2.E16(PS_MIO31) ; port P0_USB_NXT

### Notes on the sheet
- ZYNQ BANK 501
- 1.8V Interface IO
- (in symbol TitleBlock0) Title; Size; Document Number; Rev; Date:; Sheet; of
- (in symbol ZYNQ_7Z020_CLG400, part C) BANK 501; Ethernet 0 RGMII; USB0/ Ethernet1; USB1

### Library data of the parts
C17 = CAP1210_100UF_X5R_LOESR: as C286 on sheet 02-ZYNQ BANK 0; DEVICE: CAP1210_100UF_X5R_LOESR; Vendor: MURATA; Vendor PN: GRM32ER60J107ME20L; PCB Footprint: C1210
C18 C19 = CAP0402_4P7UF_X5R: as C13 on sheet 03-ZYNQ BANK 500; DEVICE: CAP0402_4P7UF_X5R; Vendor: TDK; Vendor PN: C1005X5R0J475K; PCB Footprint: C0402
C20-C22 = CAP0402_0P47UF_X5R: as C14 on sheet 03-ZYNQ BANK 500; DEVICE: CAP0402_0P47UF_X5R; Vendor: TDK; Vendor PN: C1005X5R1C474K; PCB Footprint: C0402
C23 = CAP0402_10NF_X7R_16V: CAP, 0402, 10NF, X7R, 16V; MFG PART NO: C1005X7R1C103K; MFG: TDK; ALT_SYMBOLS: C0402_BGA; Vendor: TDK; Vendor PN: C1005X7R1C103K; PCB Footprint: C0402
R59 R60 R296 = RES0402_0: as R80 on sheet 02-ZYNQ BANK 0; DEVICE: RES0402_0; Vendor PN: CRCW04020000Z0ED; PCB Footprint: R0402
R61 = RES0402_4K75: as R4 on sheet 02-ZYNQ BANK 0; DEVICE: RES0402_4K75; Vendor PN: CRCW04024K75FKED; PCB Footprint: R0402
R62 R63 = RES0402_1K: as R11 on sheet 02-ZYNQ BANK 0; DEVICE: RES0402_1K; Vendor PN: CRCW04021K00FKED; PCB Footprint: R0402
U2 = ZYNQ_7Z020_CLG400: as U2 on sheet 02-ZYNQ BANK 0; Vendor: XILINX; DEVICE: ZYNQ_7Z020_CLG400; PCB Footprint: CBGA400_17SQ_1P6H_P8MMP; Supplier 1: Digi-Key
*#4 = TitleBlock0: Page Create Date: March  8, 1995; Page Modify Date: *

## Sheet 05-GIGE PORT.SchDoc
size 513 x 386 mm
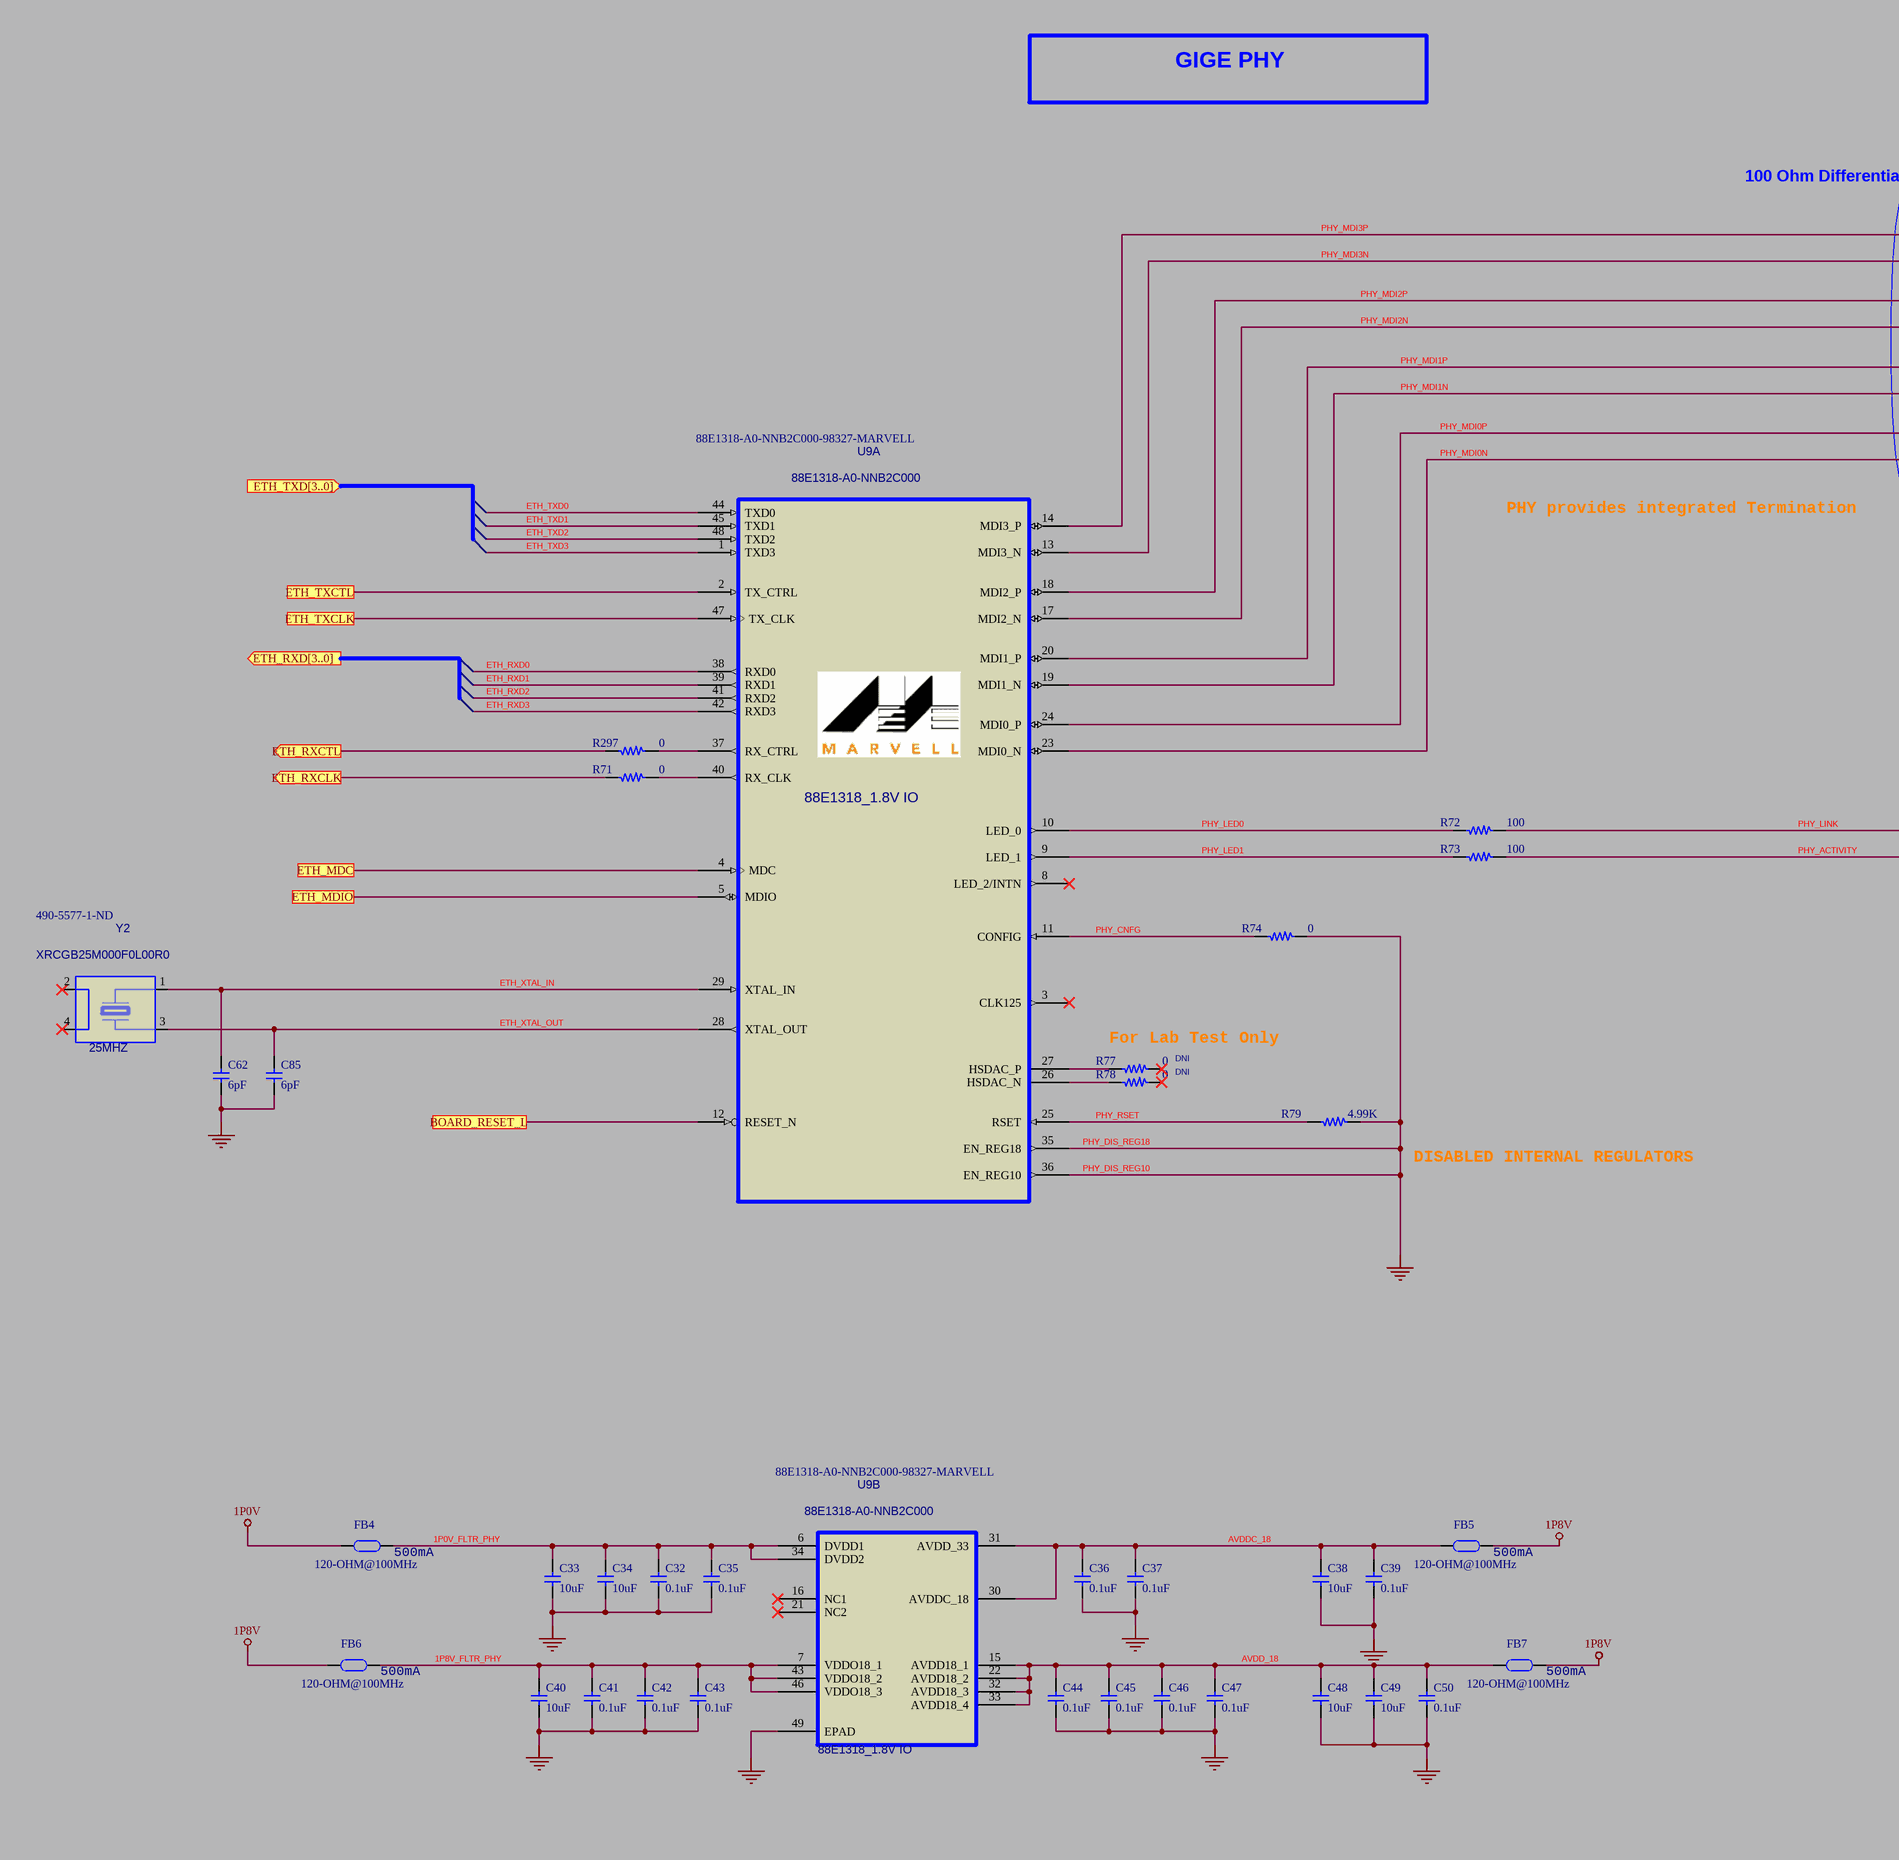
[diagram p6: 05-GIGE PORT.SchDoc, left]
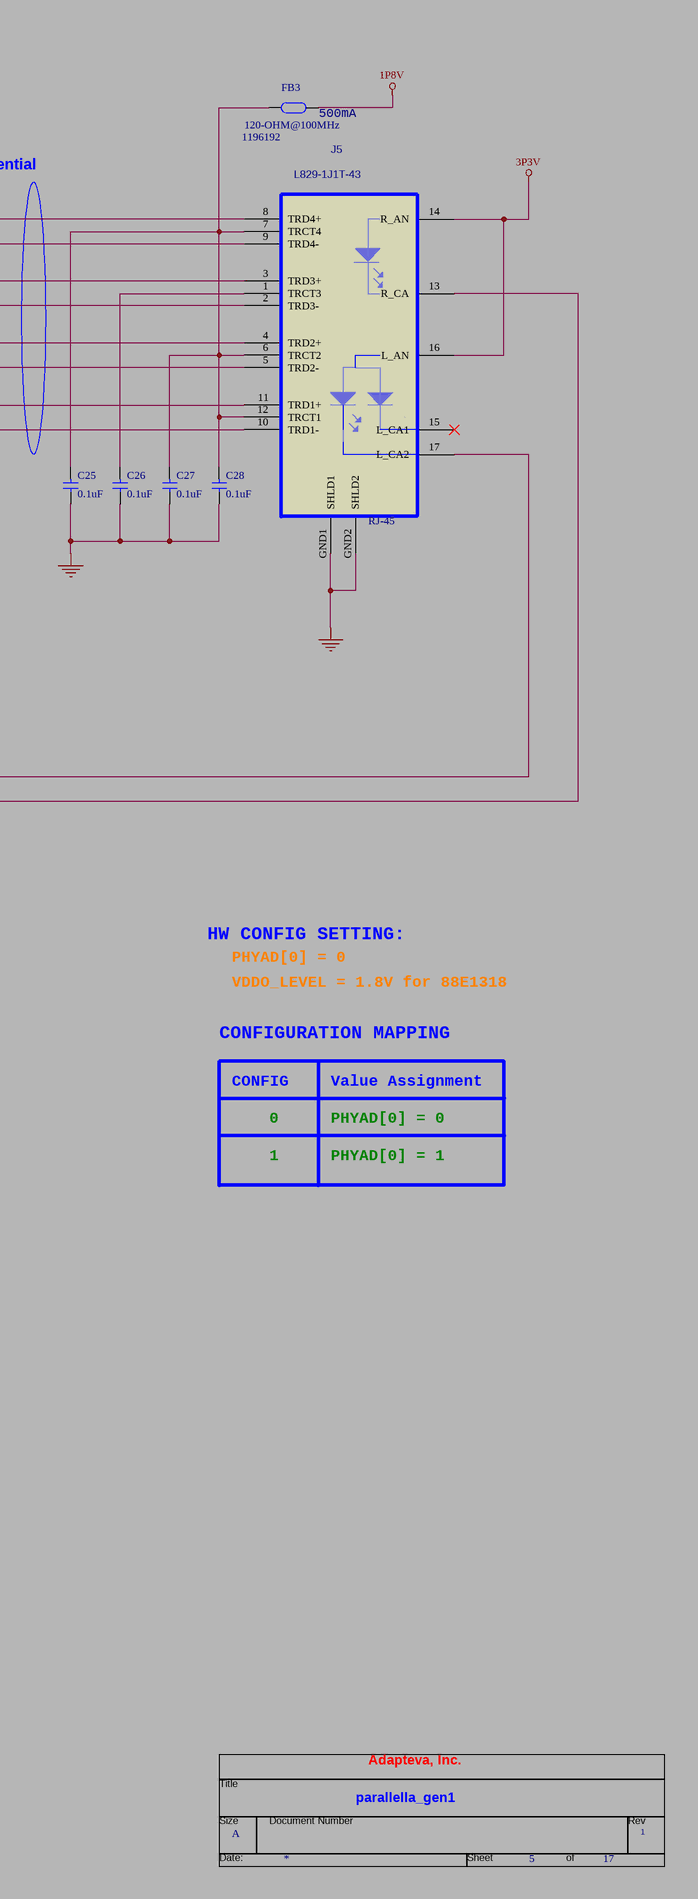
[diagram p7: 05-GIGE PORT.SchDoc, right]

### Parts
(Parts that share a designator on the sheet are numbered #1, #2 ... from top to bottom, then left to right.)
*#5  RevCode: 1  Title: parallella_gen1  Page Size: A  Page Number: 5  Page Count: 17  OrgAddr1: Adapteva, Inc.  (hidden comment: TitleBlock0)  (graphical)
C25  0.1uF  [C0402]
C26  0.1uF  [C0402]
C27  0.1uF  [C0402]
C28  0.1uF  [C0402]
C32  0.1uF  [C0402]
C33  10uF  [C0603]
C34  10uF  [C0603]
C35  0.1uF  [C0402]
C36  0.1uF  [C0402]
C37  0.1uF  [C0402]
C38  10uF  [C0603]
C39  0.1uF  [C0402]
C40  10uF  [C0603]
C41  0.1uF  [C0402]
C42  0.1uF  [C0402]
C43  0.1uF  [C0402]
C44  0.1uF  [C0402]
C45  0.1uF  [C0402]
C46  0.1uF  [C0402]
C47  0.1uF  [C0402]
C48  10uF  [C0603]
C49  10uF  [C0603]
C50  0.1uF  [C0402]
C62  6pF  [C0402]
C85  6pF  [C0402]
FB3  120-OHM@100MHz  [FBEAD_0402]
FB4  120-OHM@100MHz  [FBEAD_0402]
FB5  120-OHM@100MHz  [FBEAD_0402]
FB6  120-OHM@100MHz  [FBEAD_0402]
FB7  120-OHM@100MHz  [FBEAD_0402]
J5  RJ-45  MFG PART NO: L829-1J1T-43  Supplier Part Number 1: 1196192  [RJ45_17PINS_2LED]
R71  0  [R0402]
R72  100  [R0402]
R73  100  [R0402]
R74  0  [R0402]
R77  0  INSTALL: DNI  [R0402]
R78  0  INSTALL: DNI  [R0402]
R79  4.99K  [R0402]
R297  0  [R0402]
U9  88E1318_1.8V IO  Vendor PN: 88E1318-A0-NNB2C000  Supplier Part Number 1: 88E1318-A0-NNB2C000-98327-MARVELL  [QFN48_7SQXP5PX1MMH_3P1PAD]  (parts A,B of 2)
Y2  25MHZ  Vendor PN: XRCGB25M000F0L00R0  Supplier Part Number 1: 490-5577-1-ND  [OSC4_1P6X2X7MMH]

### Ports
BOARD_RESET_L, ETH_MDC, ETH_MDIO, ETH_RXCLK (out), ETH_RXCTL (out), ETH_RXD[3..0] (out), ETH_TXCLK, ETH_TXCTL, ETH_TXD[3..0] (in)

### Nets
1P0V: FB4.1
1P8V: FB3.2 FB5.2 FB6.1 FB7.2
3P3V: J5.14(R_AN) J5.16(L_AN)
PHY_DIS_REG10: C25.2 C26.2 C27.2 C28.2 C32.2 C33.2 C34.2 C35.2 C36.2 C37.2 C38.2 C39.2 C40.2 C41.2 C42.2 C43.2 C44.2 C45.2 C46.2 C47.2 C48.2 C49.2 C50.2 C62.2 C85.2 J5.GND1(SHLD1) J5.GND2(SHLD2) R74.2 R79.2 U9.35(EN_REG18) U9.36(EN_REG10) U9.49(EPAD)  [also labelled GND, PHY_DIS_REG18]
1P0V_FLTR_PHY: C32.1 C33.1 C34.1 C35.1 FB4.2 U9.6(DVDD1) U9.34(DVDD2)
1P8V_FLTR_PHY: C40.1 C41.1 C42.1 C43.1 FB6.2 U9.7(VDDO18_1) U9.43(VDDO18_2) U9.46(VDDO18_3)
AVDD_18: C44.1 C45.1 C46.1 C47.1 C48.1 C49.1 C50.1 FB7.1 U9.15(AVDD18_1) U9.22(AVDD18_2) U9.32(AVDD18_3) U9.33(AVDD18_4)
AVDDC_18: C36.1 C37.1 C38.1 C39.1 FB5.1 U9.30(AVDDC_18) U9.31(AVDD_33)
ETH_RXD0: U9.38(RXD0)
ETH_RXD1: U9.39(RXD1)
ETH_RXD2: U9.41(RXD2)
ETH_RXD3: U9.42(RXD3)
ETH_TXD0: U9.44(TXD0)
ETH_TXD1: U9.45(TXD1)
ETH_TXD2: U9.48(TXD2)
ETH_TXD3: U9.1(TXD3)
ETH_XTAL_IN: C62.1 U9.29(XTAL_IN) Y2.1
ETH_XTAL_OUT: C85.1 U9.28(XTAL_OUT) Y2.3
PHY_ACTIVITY: J5.13(R_CA) R73.2
PHY_CNFG: R74.1 U9.11(CONFIG)
PHY_LED0: R72.1 U9.10(LED_0)
PHY_LED1: R73.1 U9.9(LED_1)
PHY_LINK: J5.17(L_CA2) R72.2
PHY_MDI0N: J5.10(TRD1-) U9.23(MDI0_N)
PHY_MDI0P: J5.11(TRD1+) U9.24(MDI0_P)
PHY_MDI1N: J5.5(TRD2-) U9.19(MDI1_N)
PHY_MDI1P: J5.4(TRD2+) U9.20(MDI1_P)
PHY_MDI2N: J5.2(TRD3-) U9.17(MDI2_N)
PHY_MDI2P: J5.3(TRD3+) U9.18(MDI2_P)
PHY_MDI3N: J5.9(TRD4-) U9.13(MDI3_N)
PHY_MDI3P: J5.8(TRD4+) U9.14(MDI3_P)
PHY_RSET: R79.1 U9.25(RSET)
NetC25_1: C25.1 C27.1 C28.1 FB3.1 J5.6(TRCT2) J5.7(TRCT4) J5.12(TRCT1)
NetC26_1: C26.1 J5.1(TRCT3)
NetR59_2: U9.47(TX_CLK) ; port ETH_TXCLK
NetR60_2: U9.4(MDC) ; port ETH_MDC
NetR61_1: U9.5(MDIO) ; port ETH_MDIO
NetR71_1: R71.1 ; port ETH_RXCLK
NetR71_2: R71.2 U9.40(RX_CLK)
NetR77_1: R77.1 U9.27(HSDAC_P)
NetR78_1: R78.1 U9.26(HSDAC_N)
NetR295_2: U9.12(RESET_N) ; port BOARD_RESET_L
NetR296_2: U9.2(TX_CTRL) ; port ETH_TXCTL
NetR297_1: R297.1 ; port ETH_RXCTL
NetR297_2: R297.2 U9.37(RX_CTRL)

Not connected (* = marked no-connect by the designer): J5 15(L_CA1)*; R77 2*; R78 2*; U9 3(CLK125)* 8(LED_2/INTN)* 16(NC1)* 21(NC2)*; Y2 2* 4*

### Notes on the sheet
- GIGE PHY
- 100 Ohm Differential
- PHY provides integrated Termination
- For Lab Test Only
- HW CONFIG SETTING:
- PHYAD[0] = 0
- VDDO_LEVEL = 1.8V for 88E1318
- DISABLED INTERNAL REGULATORS
- CONFIGURATION MAPPING
- CONFIG
- Value Assignment
- 0
- 1
- PHYAD[0] = 1
- (in symbol BLM15AG121SN1D) 500mA
- (in symbol TitleBlock0) Title; Size; Document Number; Rev; Date:; Sheet; of

### Library data of the parts
C25-C28 C32 C35-C37 C39 C41-C47 C50 = CAP0402_0P1UF_X5R_35V: as C9 on sheet 02-ZYNQ BANK 0; DEVICE: CAP0402_0P1UF_X5R_35V; MFG PART NO: GMK105BJ104KV-F; MFG: TAIYO YUDEN; PCB Footprint: C0402
C33 C34 C38 C40 C48 C49 = CAP0603_10UF_X5R: as C53 on sheet 02-ZYNQ BANK 0; DEVICE: CAP0603_10UF_X5R; Vendor: TAIYO YUDEN; Vendor PN: LMK107BJ106MALTD; PCB Footprint: C0603
C62 C85 = CAP0402_6PF_NPO_50V: as C54 on sheet 02-ZYNQ BANK 0; DEVICE: CAP0402_6PF_NPO_50V; MFG PART NO: C1005COG1H060D050BA; MFG: TDK; PCB Footprint: C0402
FB3-FB7 = BLM15AG121SN1D: FERRITE, BEAD, 0402, 120 OHM@ 100MHZ, 500mA, SMT; Vendor: MURATA; Vendor PN: BLM15AG121SN1D; DEVICE: BLM15AG121SN1D; MFG: MURATA; MFG PART NO: BLM15AG121SN1D; PCB Footprint: FBEAD_0402
J5 = RJ45-10_100_1000-BELFUSE: RJ45 JACK, INTEGRATED MAG AND LED; Vendor PN: L829-1J1T-43; Vendor: BEL FUSE; DEVICE: RJ45-10_100_1000-BELFUSE; MFG: BEL FUSE; PCB Footprint: RJ45_17PINS_2LED; Supplier 1: Conrad
R71 R74 R77 R78 R297 = RES0402_0: as R80 on sheet 02-ZYNQ BANK 0; DEVICE: RES0402_0; Vendor PN: CRCW04020000Z0ED; PCB Footprint: R0402
R72 R73 = RES0402_100: RES, 0402, 100, 1%; ALT_SYMBOLS: R0402_BGA; Vendor PN: CRCW0402100RFKED; Vendor: VISHAY/DALE; MFG: VISHAY; MFG PART NO: CRCW0402100RFKED; DEVICE: RES0402_100; PCB Footprint: R0402
R79 = RES0402_4K99: RES, 0402, 4.99K, 1%; Vendor PN: CRCW04024K99FKED; Vendor: VISHAY/DALE; MFG: VISHAY; ALT_SYMBOLS: R0402_BGA; MFG PART NO: CRCW04024K99FKED; DEVICE: RES0402_4K99; PCB Footprint: R0402
U9 = 88E1318_QFN48: IC, GIGE PHY, QFN48; Vendor: MARVELL; DEVICE: 88E1318_QFN48; PCB Footprint: QFN48_7SQXP5PX1MMH_3P1PAD; Supplier 1: Bison Technologies
Y2 = XTAL_4P_25MHZ: XTAL, 2X1.6MM, 25MHZ, 4PIN, SMT; Vendor: MURATA; DEVICE: XTAL_4P_25MHZ; PCB Footprint: OSC4_1P6X2X7MMH; Supplier 1: Digi-Key
*#5 = TitleBlock0: Page Create Date: March  8, 1995; Page Modify Date: *

## Sheet 06-USB PORTS.SchDoc
size 513 x 386 mm
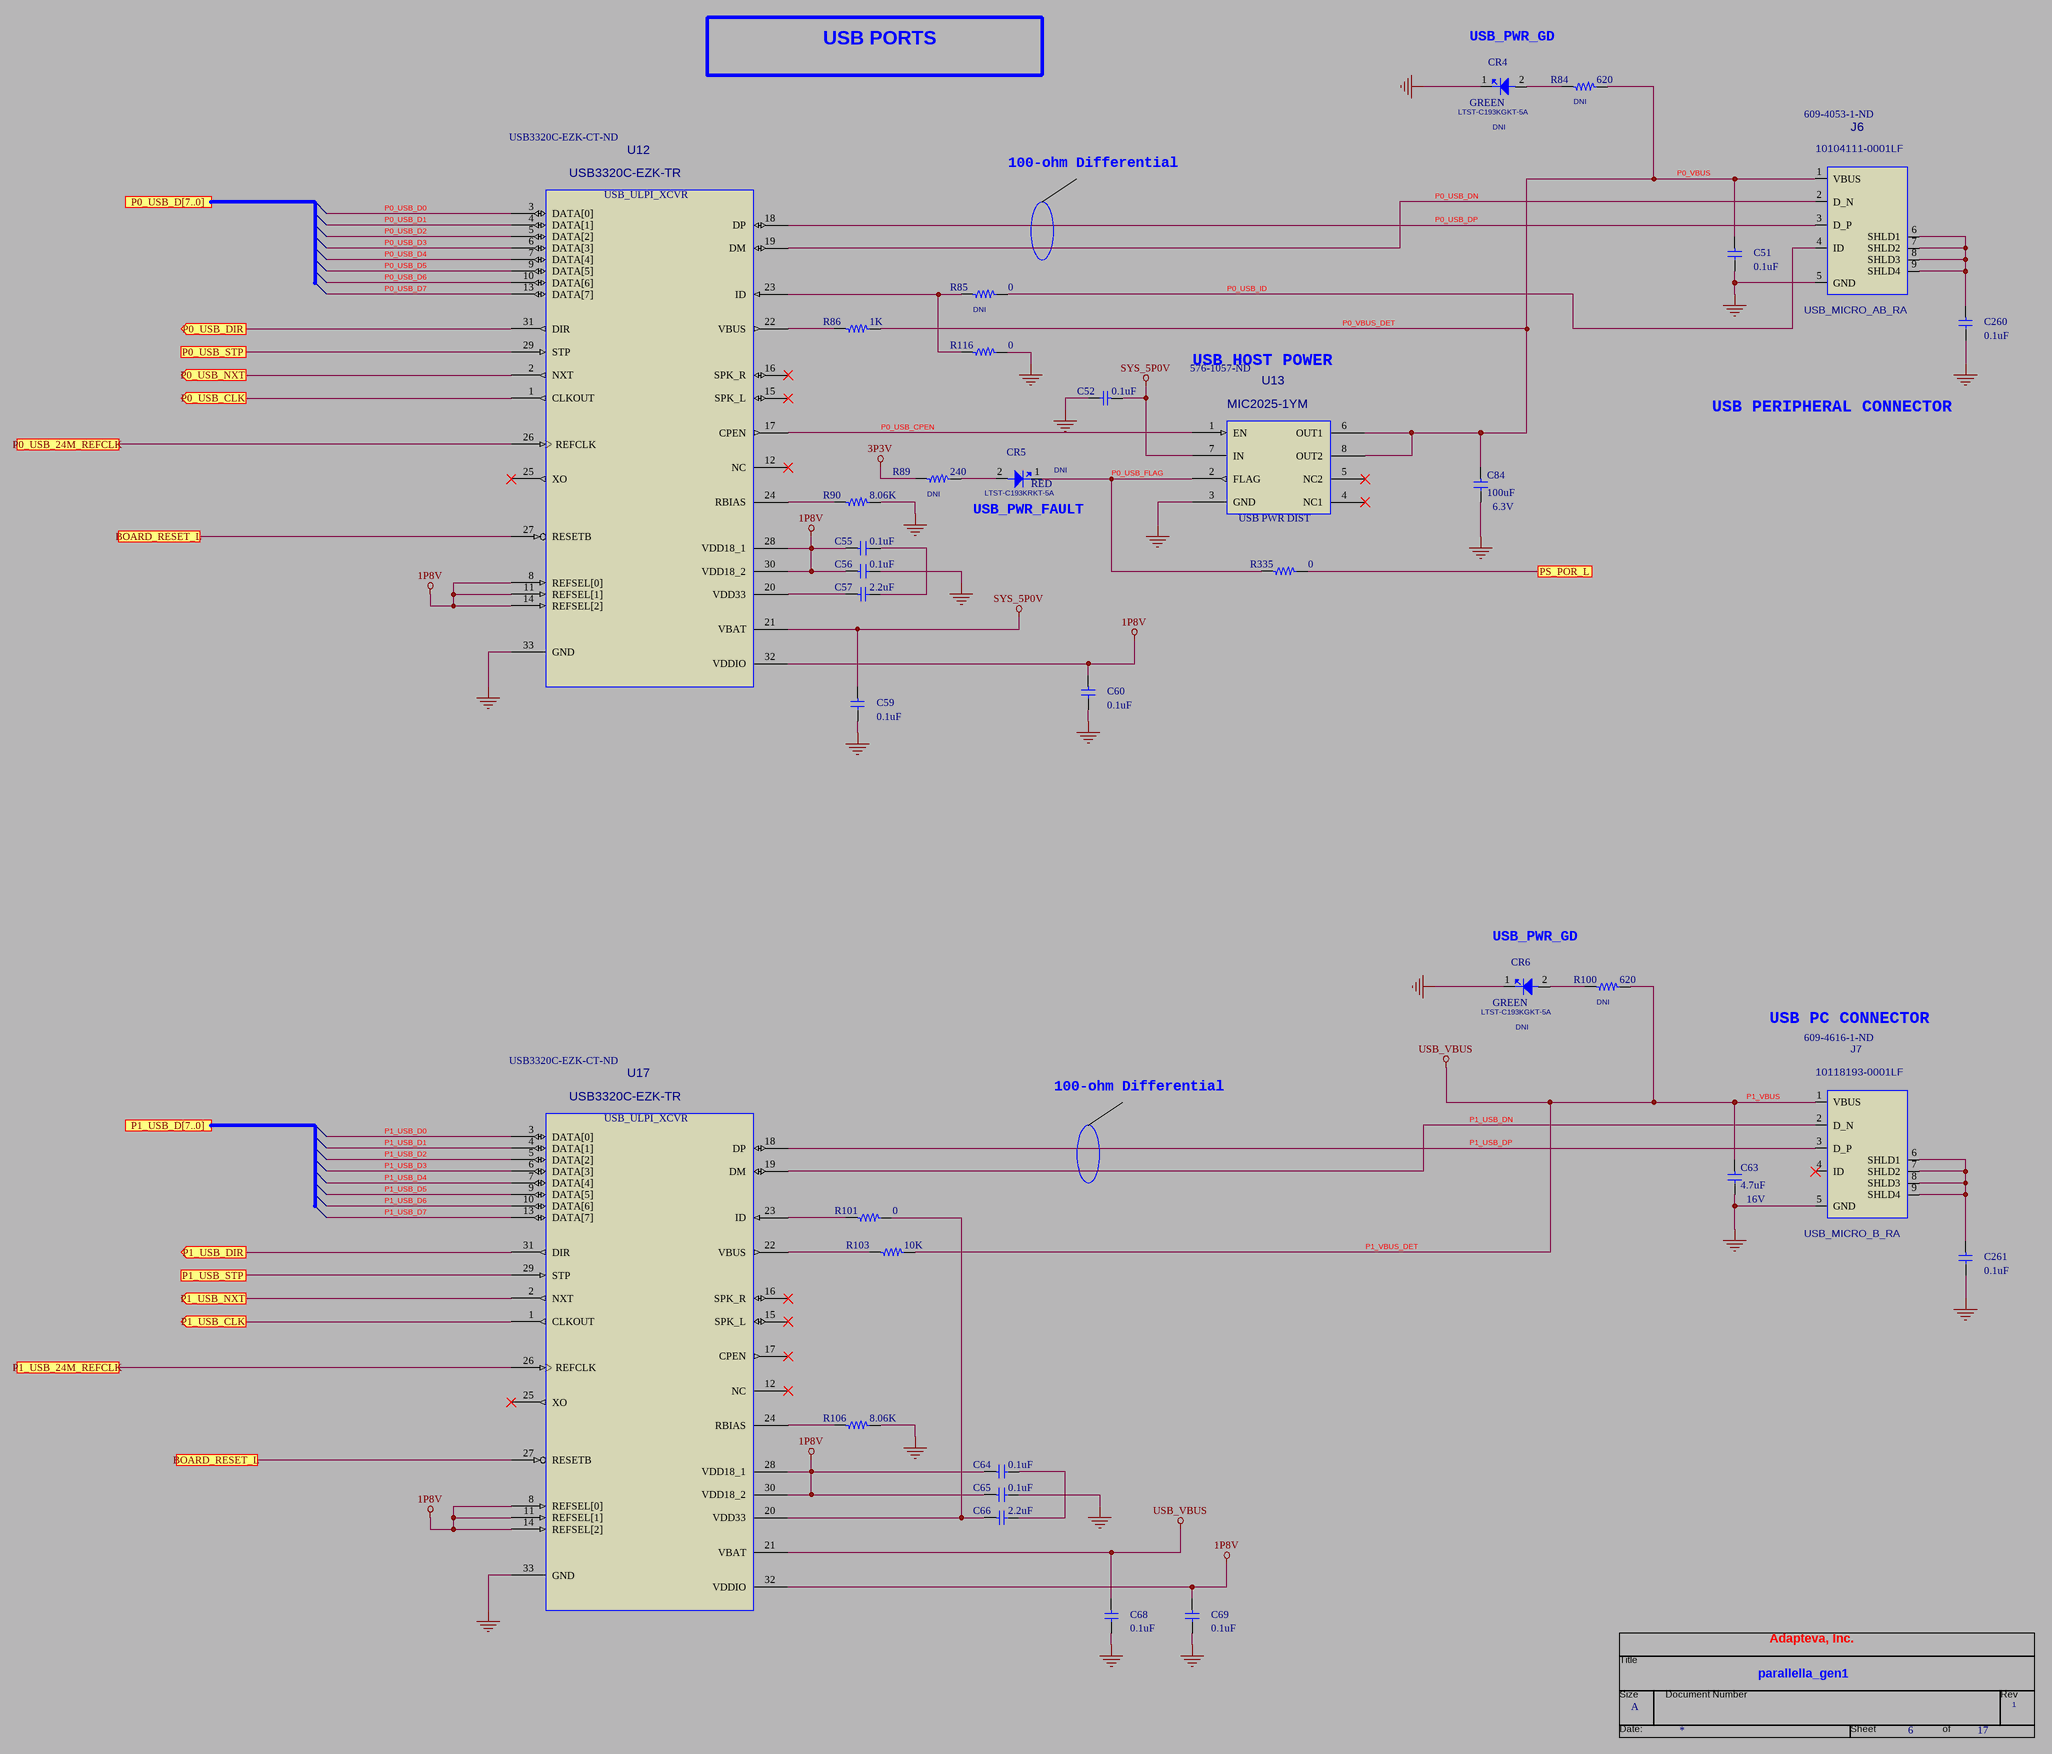
[diagram p8: 06-USB PORTS.SchDoc]

### Parts
(Parts that share a designator on the sheet are numbered #1, #2 ... from top to bottom, then left to right.)
*#6  RevCode: 1  Title: parallella_gen1  Page Size: A  Page Number: 6  Page Count: 17  OrgAddr1: Adapteva, Inc.  (hidden comment: TitleBlock0)  (graphical)
C51  0.1uF  [C0402]
C52  0.1uF  [C0402]
C55  0.1uF  [C0402]
C56  0.1uF  [C0402]
C57  2.2uF  [C0402]
C59  0.1uF  [C0402]
C60  0.1uF  [C0402]
C63  4.7uF  VOLTAGE: 16V  [C0603]
C64  0.1uF  [C0402]
C65  0.1uF  [C0402]
C66  2.2uF  [C0402]
C68  0.1uF  [C0402]
C69  0.1uF  [C0402]
C84  100uF  VOLTAGE: 6.3V  [C1210]
C260  0.1uF  [C0402]
C261  0.1uF  [C0402]
CR4  GREEN  Vendor PN: LTST-C193KGKT-5A  INSTALL: DNI  [LED_0603]
CR5  RED  Vendor PN: LTST-C193KRKT-5A  INSTALL: DNI  [LED_0603]
CR6  GREEN  Vendor PN: LTST-C193KGKT-5A  INSTALL: DNI  [LED_0603]
J6  USB_MICRO_AB_RA  MFG PART NO: 10104111-0001LF  Supplier Part Number 1: 609-4053-1-ND  [USB_MICRO5P_5X7X3P07MMH]
J7  USB_MICRO_B_RA  MFG PART NO: 10118193-0001LF  Supplier Part Number 1: 609-4616-1-ND  [USB_MICROB_5P05X7P86X3P1MM_RH]
R84  620  INSTALL: DNI  [R0402]
R85  0  INSTALL: DNI  [R0402]
R86  1K  [R0402]
R89  240  INSTALL: DNI  [R0402]
R90  8.06K  [R0402]
R100  620  INSTALL: DNI  [R0402]
R101  0  [R0402]
R103  10K  [R0402]
R106  8.06K  [R0402]
R116  0  [R0402]
R335  0  [R0402]
U12  USB_ULPI_XCVR  Vendor PN: USB3320C-EZK-TR  Supplier Part Number 1: USB3320C-EZK-CT-ND  [QFN32_5SQXP9H_P5MMP_3P45PAD]
U13  USB PWR DIST  Vendor PN: MIC2025-1YM  Supplier Part Number 1: 576-1057-ND  [SOIC8_33P94X4P93X1P63H_P65P]
U17  USB_ULPI_XCVR  Vendor PN: USB3320C-EZK-TR  Supplier Part Number 1: USB3320C-EZK-CT-ND  [QFN32_5SQXP9H_P5MMP_3P45PAD]

### Ports
BOARD_RESET_L, P0_USB_24M_REFCLK, P0_USB_CLK (out), P0_USB_D[7..0], P0_USB_DIR (out), P0_USB_NXT (out), P0_USB_STP, P1_USB_24M_REFCLK, P1_USB_CLK (out), P1_USB_D[7..0], P1_USB_DIR (out), P1_USB_NXT (out), P1_USB_STP, PS_POR_L

### Nets
1P8V: C55.1 C56.1 C60.1 C64.1 C65.1 C69.1 U12.8(REFSEL[0]) U12.11(REFSEL[1]) U12.14(REFSEL[2]) U12.28(VDD18_1) U12.30(VDD18_2) U12.32(VDDIO) U17.8(REFSEL[0]) U17.11(REFSEL[1]) U17.14(REFSEL[2]) U17.28(VDD18_1) U17.30(VDD18_2) U17.32(VDDIO)
3P3V: R89.1
GND: C51.2 C52.2 C56.2 C59.2 C60.2 C63.2 C65.2 C68.2 C69.2 C84.2 C260.2 C261.2 CR4.1(C) CR6.1(C) J6.5(GND) J7.5(GND) R90.2 R106.2 R116.2 U12.33(GND) U13.3(GND) U17.33(GND)  [project net PHY_DIS_REG10]
P1_VBUS: C63.1 C68.1 J7.1(VBUS) R100.2 R103.2 U17.21(VBAT)  [also labelled P1_VBUS_DET, USB_VBUS]
SYS_5P0V: C52.1 C59.1 U12.21(VBAT) U13.7(IN)
P0_USB_CPEN: U12.17(CPEN) U13.1(EN)
P0_USB_D0: U12.3(DATA[0])
P0_USB_D1: U12.4(DATA[1])
P0_USB_D2: U12.5(DATA[2])
P0_USB_D3: U12.6(DATA[3])
P0_USB_D4: U12.7(DATA[4])
P0_USB_D5: U12.9(DATA[5])
P0_USB_D6: U12.10(DATA[6])
P0_USB_D7: U12.13(DATA[7])
P0_USB_DN: J6.2(D_N) U12.19(DM)
P0_USB_DP: J6.3(D_P) U12.18(DP)
P0_USB_FLAG: CR5.1(C) R335.1 U13.2(FLAG)
P0_USB_ID: J6.4(ID) R85.2
P0_VBUS: C51.1 C84.1 J6.1(VBUS) R84.2 R86.2 U13.6(OUT1) U13.8(OUT2)  [also labelled P0_VBUS_DET]
P1_USB_D0: U17.3(DATA[0])
P1_USB_D1: U17.4(DATA[1])
P1_USB_D2: U17.5(DATA[2])
P1_USB_D3: U17.6(DATA[3])
P1_USB_D4: U17.7(DATA[4])
P1_USB_D5: U17.9(DATA[5])
P1_USB_D6: U17.10(DATA[6])
P1_USB_D7: U17.13(DATA[7])
P1_USB_DN: J7.2(D_N) U17.19(DM)
P1_USB_DP: J7.3(D_P) U17.18(DP)
NetC55_2: C55.2 C57.2
NetC57_1: C57.1 U12.20(VDD33)
NetC64_2: C64.2 C66.2
NetC66_1: C66.1 R101.2 U17.20(VDD33)
NetC260_1: C260.1 J6.6(SHLD1) J6.7(SHLD2) J6.8(SHLD3) J6.9(SHLD4)
NetC261_1: C261.1 J7.6(SHLD1) J7.7(SHLD2) J7.8(SHLD3) J7.9(SHLD4)
NetCR4_2: CR4.2(A) R84.1
NetCR5_2: CR5.2(A) R89.2
NetCR6_2: CR6.2(A) R100.1
NetR85_1: R85.1 R116.1 U12.23(ID)
NetR86_1: R86.1 U12.22(VBUS)
NetR90_1: R90.1 U12.24(RBIAS)
NetR95_2: R335.2 ; port PS_POR_L
NetR99_2: U12.26(REFCLK) ; port P0_USB_24M_REFCLK
NetR101_1: R101.1 U17.23(ID)
NetR103_1: R103.1 U17.22(VBUS)
NetR106_1: R106.1 U17.24(RBIAS)
NetR110_2: U17.26(REFCLK) ; port P1_USB_24M_REFCLK
NetR295_2: U12.27(RESETB) U17.27(RESETB) ; port BOARD_RESET_L
NetU2_A9: U17.2(NXT) ; port P1_USB_NXT
NetU2_A11: U12.1(CLKOUT) ; port P0_USB_CLK
NetU2_B12: U17.1(CLKOUT) ; port P1_USB_CLK
NetU2_C13: U12.31(DIR) ; port P0_USB_DIR
NetU2_C15: U12.29(STP) ; port P0_USB_STP
NetU2_C17: U17.31(DIR) ; port P1_USB_DIR
NetU2_E12: U17.29(STP) ; port P1_USB_STP
NetU2_E16: U12.2(NXT) ; port P0_USB_NXT

Not connected (* = marked no-connect by the designer): J7 4(ID)*; U12 12(NC)* 15(SPK_L)* 16(SPK_R)* 25(XO)*; U13 4(NC1)* 5(NC2)*; U17 12(NC)* 15(SPK_L)* 16(SPK_R)* 17(CPEN)* 25(XO)*

### Notes on the sheet
- USB_PWR_GD
- USB PORTS
- 100-ohm Differential
- USB HOST POWER
- USB PERIPHERAL CONNECTOR
- USB_PWR_FAULT
- USB PC CONNECTOR
- (in symbol TitleBlock0) Title; Size; Document Number; Rev; Date:; Sheet; of

### Library data of the parts
C51 C52 C55 C56 C59 C60 C64 C65 C68 C69 C260 C261 = CAP0402_0P1UF_X5R_35V: as C9 on sheet 02-ZYNQ BANK 0; DEVICE: CAP0402_0P1UF_X5R_35V; MFG PART NO: GMK105BJ104KV-F; MFG: TAIYO YUDEN; PCB Footprint: C0402
C57 C66 = CAP0402_2P2UF_X5R: CAP, 0402, 2.2UF, X5R, 6.3V; MFG PART NO: C1005X5R0J225M; MFG: TDK; ALT_SYMBOLS: C0402_BGA; DEVICE: CAP0402_2P2UF_X5R; Vendor: TDK; Vendor PN: C1005X5R0J225M; PCB Footprint: C0402
C63 = CAP0603_4P7UF_16V_X5R: CAP, 0603, 4.7UF, X5R, 16V; MFG PART NO: C1608X5R1C475K080AC; MFG: TDK; DEVICE: CAP0603_4P7UF_16V_X5R; Vendor: TDK; Vendor PN: C1608X5R1C475K080AC; PCB Footprint: C0603
C84 = CAP1210_100UF_X5R_LOESR: as C286 on sheet 02-ZYNQ BANK 0; DEVICE: CAP1210_100UF_X5R_LOESR; Vendor: MURATA; Vendor PN: GRM32ER60J107ME20L; PCB Footprint: C1210
CR4 CR6 = LED_0603_5MA_GRN: LED, 0603, 5MA, SMT, GREEN; Voltage: 2V; MFG: LITE-ON INC; MFG PART NO: LTST-C193KGKT-5A; Vendor: LITE-ON INC; PCB Footprint: LED_0603
CR5 = LED_0603_5MA_RED: LED, 0603, 5MA, SMT, RED; Voltage: 2V; MFG: LITE-ON INC; MFG PART NO: LTST-C193KRKT-5A; Vendor: LITE-ON INC; PCB Footprint: LED_0603
J6 = USB_MICRO_AB_RA_SMT: CONN, USB, RCPT, MICRO AB, RA, SMT; MFG: FCI; DEVICE: USB_MICRO_AB_RA_SMT; Vendor: FCI; Vendor PN: 10104111-0001LF; PCB Footprint: USB_MICRO5P_5X7X3P07MMH; Supplier 1: Digi-Key
J7 = USB_MICRO_B_RA_SMT: CONN, USB, RCPT, MICRO B, RA, SMT; MFG: FCI; PCB Footprint: USB_MICROB_5P05X7P86X3P1MMH_R; DEVICE: USB_MICRO_B_RA_SMT; Vendor: FCI; Vendor PN: 10118193-0001LF; Supplier 1: Digi-Key
R84 R100 = RES0402_620: RES, 0402, 620, 1%; MFG PART NO: CRCW0402620RFKED; ALT_SYMBOLS: R0402_BGA; MFG: VISHAY; Vendor: VISHAY/DALE; DEVICE: RES0402_620; Vendor PN: CRCW0402620RFKED; PCB Footprint: R0402
R85 R101 R116 R335 = RES0402_0: as R80 on sheet 02-ZYNQ BANK 0; DEVICE: RES0402_0; Vendor PN: CRCW04020000Z0ED; PCB Footprint: R0402
R86 = RES0402_1K: as R11 on sheet 02-ZYNQ BANK 0; DEVICE: RES0402_1K; Vendor PN: CRCW04021K00FKED; PCB Footprint: R0402
R89 = RES0402_240: as R3 on sheet 02-ZYNQ BANK 0; DEVICE: RES0402_240; Vendor PN: CRCW0402240RFKED; PCB Footprint: R0402
R90 R106 = RES0402_8K06: RES, 0402, 8.06K; MFG PART NO: CRCW04028K06FKED; ALT_SYMBOLS: R0402_BGA; MFG: VISHAY; Vendor: VISHAY/DALE; DEVICE: RES0402_8K06; Vendor PN: CRCW04028K06FKED; PCB Footprint: R0402
R103 = RES0402_10K: RES, 0402, 10K; MFG PART NO: CRCW040210K0FKED; ALT_SYMBOLS: R0402_BGA; MFG: VISHAY; Vendor: VISHAY/DALE; DEVICE: RES0402_10K; Vendor PN: CRCW040210K0FKED; PCB Footprint: R0402
U12 U17 = USB3320_ULPI_XCVR: IC, USB ULPI XCVR, SINGLE SUPPLY, QFN32; Vendor: SMSC; DEVICE: USB3320_ULPI_XCVR; Supplier 1: Digi-Key
U13 = MIC2025_1_USB_SW: IC, USB DISTRIBUTION SW, 1 CH, SOIC8; Vendor: MICREL; DEVICE: MIC2025_1_USB_SW; PCB Footprint: SOIC8_33P94X4P93X1P63H_P65P; Supplier 1: Digi-Key
*#6 = TitleBlock0: Page Create Date: March  8, 1995; Page Modify Date: *

## Sheet 07-ZYNQ BANK 502.SchDoc
size 513 x 386 mm
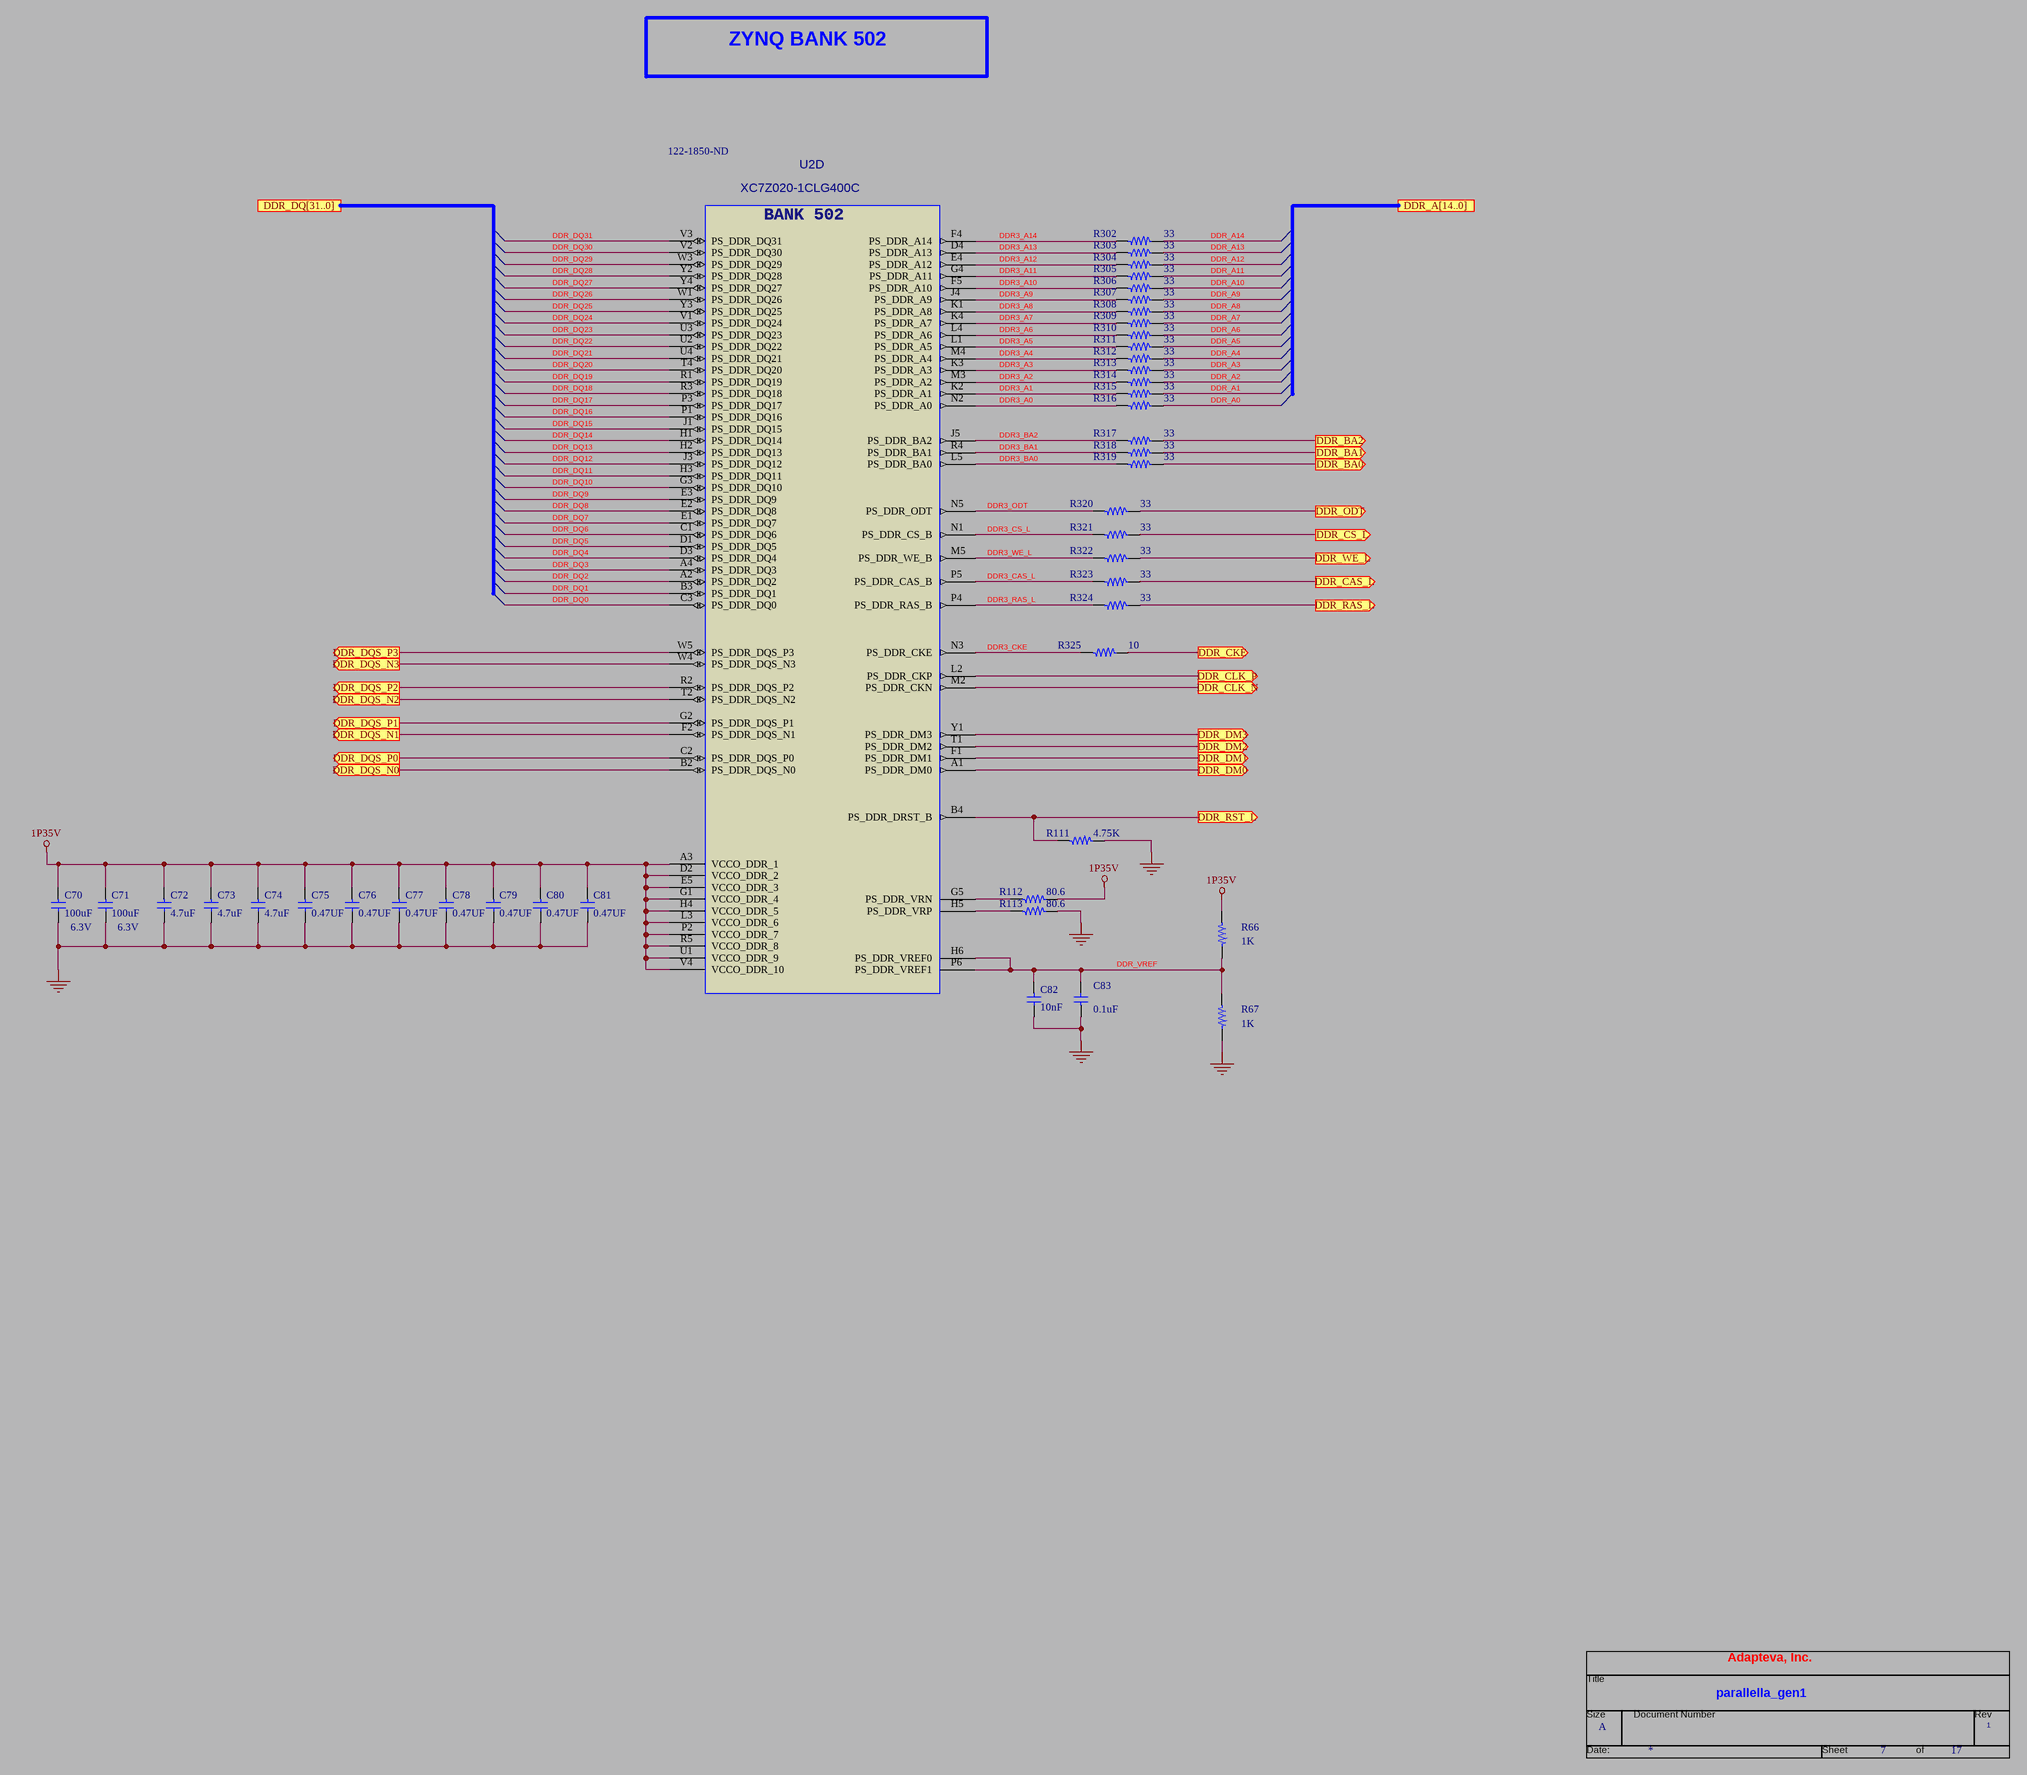
[diagram p9: 07-ZYNQ BANK 502.SchDoc]

### Parts
(Parts that share a designator on the sheet are numbered #1, #2 ... from top to bottom, then left to right.)
*#7  RevCode: 1  Title: parallella_gen1  Page Size: A  Page Number: 7  Page Count: 17  OrgAddr1: Adapteva, Inc.  (hidden comment: TitleBlock0)  (graphical)
C70  100uF  VOLTAGE: 6.3V  [C1210]
C71  100uF  VOLTAGE: 6.3V  [C1210]
C72  4.7uF  [C0402]
C73  4.7uF  [C0402]
C74  4.7uF  [C0402]
C75  0.47UF  [C0402]
C76  0.47UF  [C0402]
C77  0.47UF  [C0402]
C78  0.47UF  [C0402]
C79  0.47UF  [C0402]
C80  0.47UF  [C0402]
C81  0.47UF  [C0402]
C82  10nF  [C0402]
C83  0.1uF  [C0402]
R66  1K  [R0402]
R67  1K  [R0402]
R111  4.75K  [R0402]
R112  80.6  [R0402]
R113  80.6  [R0402]
R302  33  [R0402]
R303  33  [R0402]
R304  33  [R0402]
R305  33  [R0402]
R306  33  [R0402]
R307  33  [R0402]
R308  33  [R0402]
R309  33  [R0402]
R310  33  [R0402]
R311  33  [R0402]
R312  33  [R0402]
R313  33  [R0402]
R314  33  [R0402]
R315  33  [R0402]
R316  33  [R0402]
R317  33  [R0402]
R318  33  [R0402]
R319  33  [R0402]
R320  33  [R0402]
R321  33  [R0402]
R322  33  [R0402]
R323  33  [R0402]
R324  33  [R0402]
R325  10  [R0402]
U2  Vendor PN: XC7Z020-1CLG400C  Supplier Part Number 1: 122-1850-ND  [CBGA400_17SQ_1P6H_P8MMP]  (hidden comment: 7Z020-CLG400)  (part D of 8)

### Ports
DDR_A[14..0], DDR_BA0 (out), DDR_BA1 (out), DDR_BA2 (out), DDR_CAS_L (out), DDR_CKE (out), DDR_CLK_N (out), DDR_CLK_P (out), DDR_CS_L (out), DDR_DM0 (out), DDR_DM1 (out), DDR_DM2 (out), DDR_DM3 (out), DDR_DQ[31..0], DDR_DQS_N0 (out), DDR_DQS_N1 (out), DDR_DQS_N2 (out), DDR_DQS_N3 (out), DDR_DQS_P0 (out), DDR_DQS_P1 (out), DDR_DQS_P2 (out), DDR_DQS_P3 (out), DDR_ODT (out), DDR_RAS_L (out), DDR_RST_L (out), DDR_WE_L (out)

### Nets
1P35V: C70.1 C71.1 C72.1 C73.1 C74.1 C75.1 C76.1 C77.1 C78.1 C79.1 C80.1 C81.1 R66.1 R112.2 U2.A3(VCCO_DDR_1) U2.D2(VCCO_DDR_2) U2.E5(VCCO_DDR_3) U2.G1(VCCO_DDR_4) U2.H4(VCCO_DDR_5) U2.L3(VCCO_DDR_6) U2.P2(VCCO_DDR_7) U2.R5(VCCO_DDR_8) U2.U1(VCCO_DDR_9) U2.V4(VCCO_DDR_10)
GND: C70.2 C71.2 C72.2 C73.2 C74.2 C75.2 C76.2 C77.2 C78.2 C79.2 C80.2 C81.2 C82.2 C83.1 R67.2 R111.2 R113.2  [project net PHY_DIS_REG10]
DDR3_A0: R316.1 U2.N2(PS_DDR_A0)
DDR3_A1: R315.1 U2.K2(PS_DDR_A1)
DDR3_A2: R314.1 U2.M3(PS_DDR_A2)
DDR3_A3: R313.1 U2.K3(PS_DDR_A3)
DDR3_A4: R312.1 U2.M4(PS_DDR_A4)
DDR3_A5: R311.1 U2.L1(PS_DDR_A5)
DDR3_A6: R310.1 U2.L4(PS_DDR_A6)
DDR3_A7: R309.1 U2.K4(PS_DDR_A7)
DDR3_A8: R308.1 U2.K1(PS_DDR_A8)
DDR3_A9: R307.1 U2.J4(PS_DDR_A9)
DDR3_A10: R306.1 U2.F5(PS_DDR_A10)
DDR3_A11: R305.1 U2.G4(PS_DDR_A11)
DDR3_A12: R304.1 U2.E4(PS_DDR_A12)
DDR3_A13: R303.1 U2.D4(PS_DDR_A13)
DDR3_A14: R302.1 U2.F4(PS_DDR_A14)
DDR3_BA0: R319.1 U2.L5(PS_DDR_BA0)
DDR3_BA1: R318.1 U2.R4(PS_DDR_BA1)
DDR3_BA2: R317.1 U2.J5(PS_DDR_BA2)
DDR3_CAS_L: R323.1 U2.P5(PS_DDR_CAS_B)
DDR3_CKE: R325.1 U2.N3(PS_DDR_CKE)
DDR3_CS_L: R321.1 U2.N1(PS_DDR_CS_B)
DDR3_ODT: R320.1 U2.N5(PS_DDR_ODT)
DDR3_RAS_L: R324.1 U2.P4(PS_DDR_RAS_B)
DDR3_WE_L: R322.1 U2.M5(PS_DDR_WE_B)
DDR_A0: R316.2
DDR_A1: R315.2
DDR_A2: R314.2
DDR_A3: R313.2
DDR_A4: R312.2
DDR_A5: R311.2
DDR_A6: R310.2
DDR_A7: R309.2
DDR_A8: R308.2
DDR_A9: R307.2
DDR_A10: R306.2
DDR_A11: R305.2
DDR_A12: R304.2
DDR_A13: R303.2
DDR_A14: R302.2
DDR_DQ0: U2.C3(PS_DDR_DQ0)
DDR_DQ1: U2.B3(PS_DDR_DQ1)
DDR_DQ2: U2.A2(PS_DDR_DQ2)
DDR_DQ3: U2.A4(PS_DDR_DQ3)
DDR_DQ4: U2.D3(PS_DDR_DQ4)
DDR_DQ5: U2.D1(PS_DDR_DQ5)
DDR_DQ6: U2.C1(PS_DDR_DQ6)
DDR_DQ7: U2.E1(PS_DDR_DQ7)
DDR_DQ8: U2.E2(PS_DDR_DQ8)
DDR_DQ9: U2.E3(PS_DDR_DQ9)
DDR_DQ10: U2.G3(PS_DDR_DQ10)
DDR_DQ11: U2.H3(PS_DDR_DQ11)
DDR_DQ12: U2.J3(PS_DDR_DQ12)
DDR_DQ13: U2.H2(PS_DDR_DQ13)
DDR_DQ14: U2.H1(PS_DDR_DQ14)
DDR_DQ15: U2.J1(PS_DDR_DQ15)
DDR_DQ16: U2.P1(PS_DDR_DQ16)
DDR_DQ17: U2.P3(PS_DDR_DQ17)
DDR_DQ18: U2.R3(PS_DDR_DQ18)
DDR_DQ19: U2.R1(PS_DDR_DQ19)
DDR_DQ20: U2.T4(PS_DDR_DQ20)
DDR_DQ21: U2.U4(PS_DDR_DQ21)
DDR_DQ22: U2.U2(PS_DDR_DQ22)
DDR_DQ23: U2.U3(PS_DDR_DQ23)
DDR_DQ24: U2.V1(PS_DDR_DQ24)
DDR_DQ25: U2.Y3(PS_DDR_DQ25)
DDR_DQ26: U2.W1(PS_DDR_DQ26)
DDR_DQ27: U2.Y4(PS_DDR_DQ27)
DDR_DQ28: U2.Y2(PS_DDR_DQ28)
DDR_DQ29: U2.W3(PS_DDR_DQ29)
DDR_DQ30: U2.V2(PS_DDR_DQ30)
DDR_DQ31: U2.V3(PS_DDR_DQ31)
DDR_VREF: C82.1 C83.2 R66.2 R67.1 U2.H6(PS_DDR_VREF0) U2.P6(PS_DDR_VREF1)
NetR111_1: R111.1 U2.B4(PS_DDR_DRST_B) ; port DDR_RST_L
NetR112_1: R112.1 U2.G5(PS_DDR_VRN)
NetR113_1: R113.1 U2.H5(PS_DDR_VRP)
NetR115_1: U2.L2(PS_DDR_CKP) ; port DDR_CLK_P
NetR115_2: U2.M2(PS_DDR_CKN) ; port DDR_CLK_N
NetR317_2: R317.2 ; port DDR_BA2
NetR318_2: R318.2 ; port DDR_BA1
NetR319_2: R319.2 ; port DDR_BA0
NetR320_2: R320.2 ; port DDR_ODT
NetR321_2: R321.2 ; port DDR_CS_L
NetR322_2: R322.2 ; port DDR_WE_L
NetR323_2: R323.2 ; port DDR_CAS_L
NetR324_2: R324.2 ; port DDR_RAS_L
NetR325_2: R325.2 ; port DDR_CKE
NetU2_A1: U2.A1(PS_DDR_DM0) ; port DDR_DM0
NetU2_B2: U2.B2(PS_DDR_DQS_N0) ; port DDR_DQS_N0
NetU2_C2: U2.C2(PS_DDR_DQS_P0) ; port DDR_DQS_P0
NetU2_F1: U2.F1(PS_DDR_DM1) ; port DDR_DM1
NetU2_F2: U2.F2(PS_DDR_DQS_N1) ; port DDR_DQS_N1
NetU2_G2: U2.G2(PS_DDR_DQS_P1) ; port DDR_DQS_P1
NetU2_R2: U2.R2(PS_DDR_DQS_P2) ; port DDR_DQS_P2
NetU2_T1: U2.T1(PS_DDR_DM2) ; port DDR_DM2
NetU2_T2: U2.T2(PS_DDR_DQS_N2) ; port DDR_DQS_N2
NetU2_W4: U2.W4(PS_DDR_DQS_N3) ; port DDR_DQS_N3
NetU2_W5: U2.W5(PS_DDR_DQS_P3) ; port DDR_DQS_P3
NetU2_Y1: U2.Y1(PS_DDR_DM3) ; port DDR_DM3

### Notes on the sheet
- ZYNQ BANK 502
- (in symbol TitleBlock0) Title; Size; Document Number; Rev; Date:; Sheet; of
- (in symbol ZYNQ_7Z020_CLG400, part D) BANK 502

### Library data of the parts
C70 C71 = CAP1210_100UF_X5R_LOESR: as C286 on sheet 02-ZYNQ BANK 0; DEVICE: CAP1210_100UF_X5R_LOESR; Vendor: MURATA; Vendor PN: GRM32ER60J107ME20L; PCB Footprint: C1210
C72-C74 = CAP0402_4P7UF_X5R: as C13 on sheet 03-ZYNQ BANK 500; DEVICE: CAP0402_4P7UF_X5R; Vendor: TDK; Vendor PN: C1005X5R0J475K; PCB Footprint: C0402
C75-C81 = CAP0402_0P47UF_X5R: as C14 on sheet 03-ZYNQ BANK 500; DEVICE: CAP0402_0P47UF_X5R; Vendor: TDK; Vendor PN: C1005X5R1C474K; PCB Footprint: C0402
C82 = CAP0402_10NF_X7R_16V: as C23 on sheet 04-ZYNQ BANK 501; Vendor: TDK; Vendor PN: C1005X7R1C103K; PCB Footprint: C0402
C83 = CAP0402_0P1UF_X5R_35V: as C9 on sheet 02-ZYNQ BANK 0; DEVICE: CAP0402_0P1UF_X5R_35V; MFG PART NO: GMK105BJ104KV-F; MFG: TAIYO YUDEN; PCB Footprint: C0402
R66 R67 = RES0402_1K: as R11 on sheet 02-ZYNQ BANK 0; DEVICE: RES0402_1K; Vendor PN: CRCW04021K00FKED; PCB Footprint: R0402
R111 = RES0402_4K75: as R4 on sheet 02-ZYNQ BANK 0; DEVICE: RES0402_4K75; Vendor PN: CRCW04024K75FKED; PCB Footprint: R0402
R112 R113 = RES0402_80P6: RES, 0402, 80.6, 1%; MFG PART NO: CRCW040280R6FKED; MFG: VISHAY; Vendor: VISHAY/DALE; ALT_SYMBOLS: R0402_BGA; DEVICE: RES0402_80P6; Vendor PN: CRCW040280R6FKED; PCB Footprint: R0402
R302-R324 = RES0402_33: as R32 on sheet 03-ZYNQ BANK 500; DEVICE: RES0402_33; Vendor PN: CRCW040233R0FKED; PCB Footprint: R0402
R325 = RES0402_10: RES, 0402, 10, 1%; Vendor PN: CRCW040210R0FKED; Vendor: VISHAY/DALE; MFG: VISHAY; ALT_SYMBOLS: R0402_BGA; MFG PART NO: CRCW040210R0FKED; DEVICE: RES0402_10; PCB Footprint: R0402
U2 = ZYNQ_7Z020_CLG400: as U2 on sheet 02-ZYNQ BANK 0; Vendor: XILINX; DEVICE: ZYNQ_7Z020_CLG400; PCB Footprint: CBGA400_17SQ_1P6H_P8MMP; Supplier 1: Digi-Key
*#7 = TitleBlock0: Page Create Date: March  8, 1995; Page Modify Date: *

## Sheet 08-DDR3-256MX32.SchDoc
size 513 x 386 mm
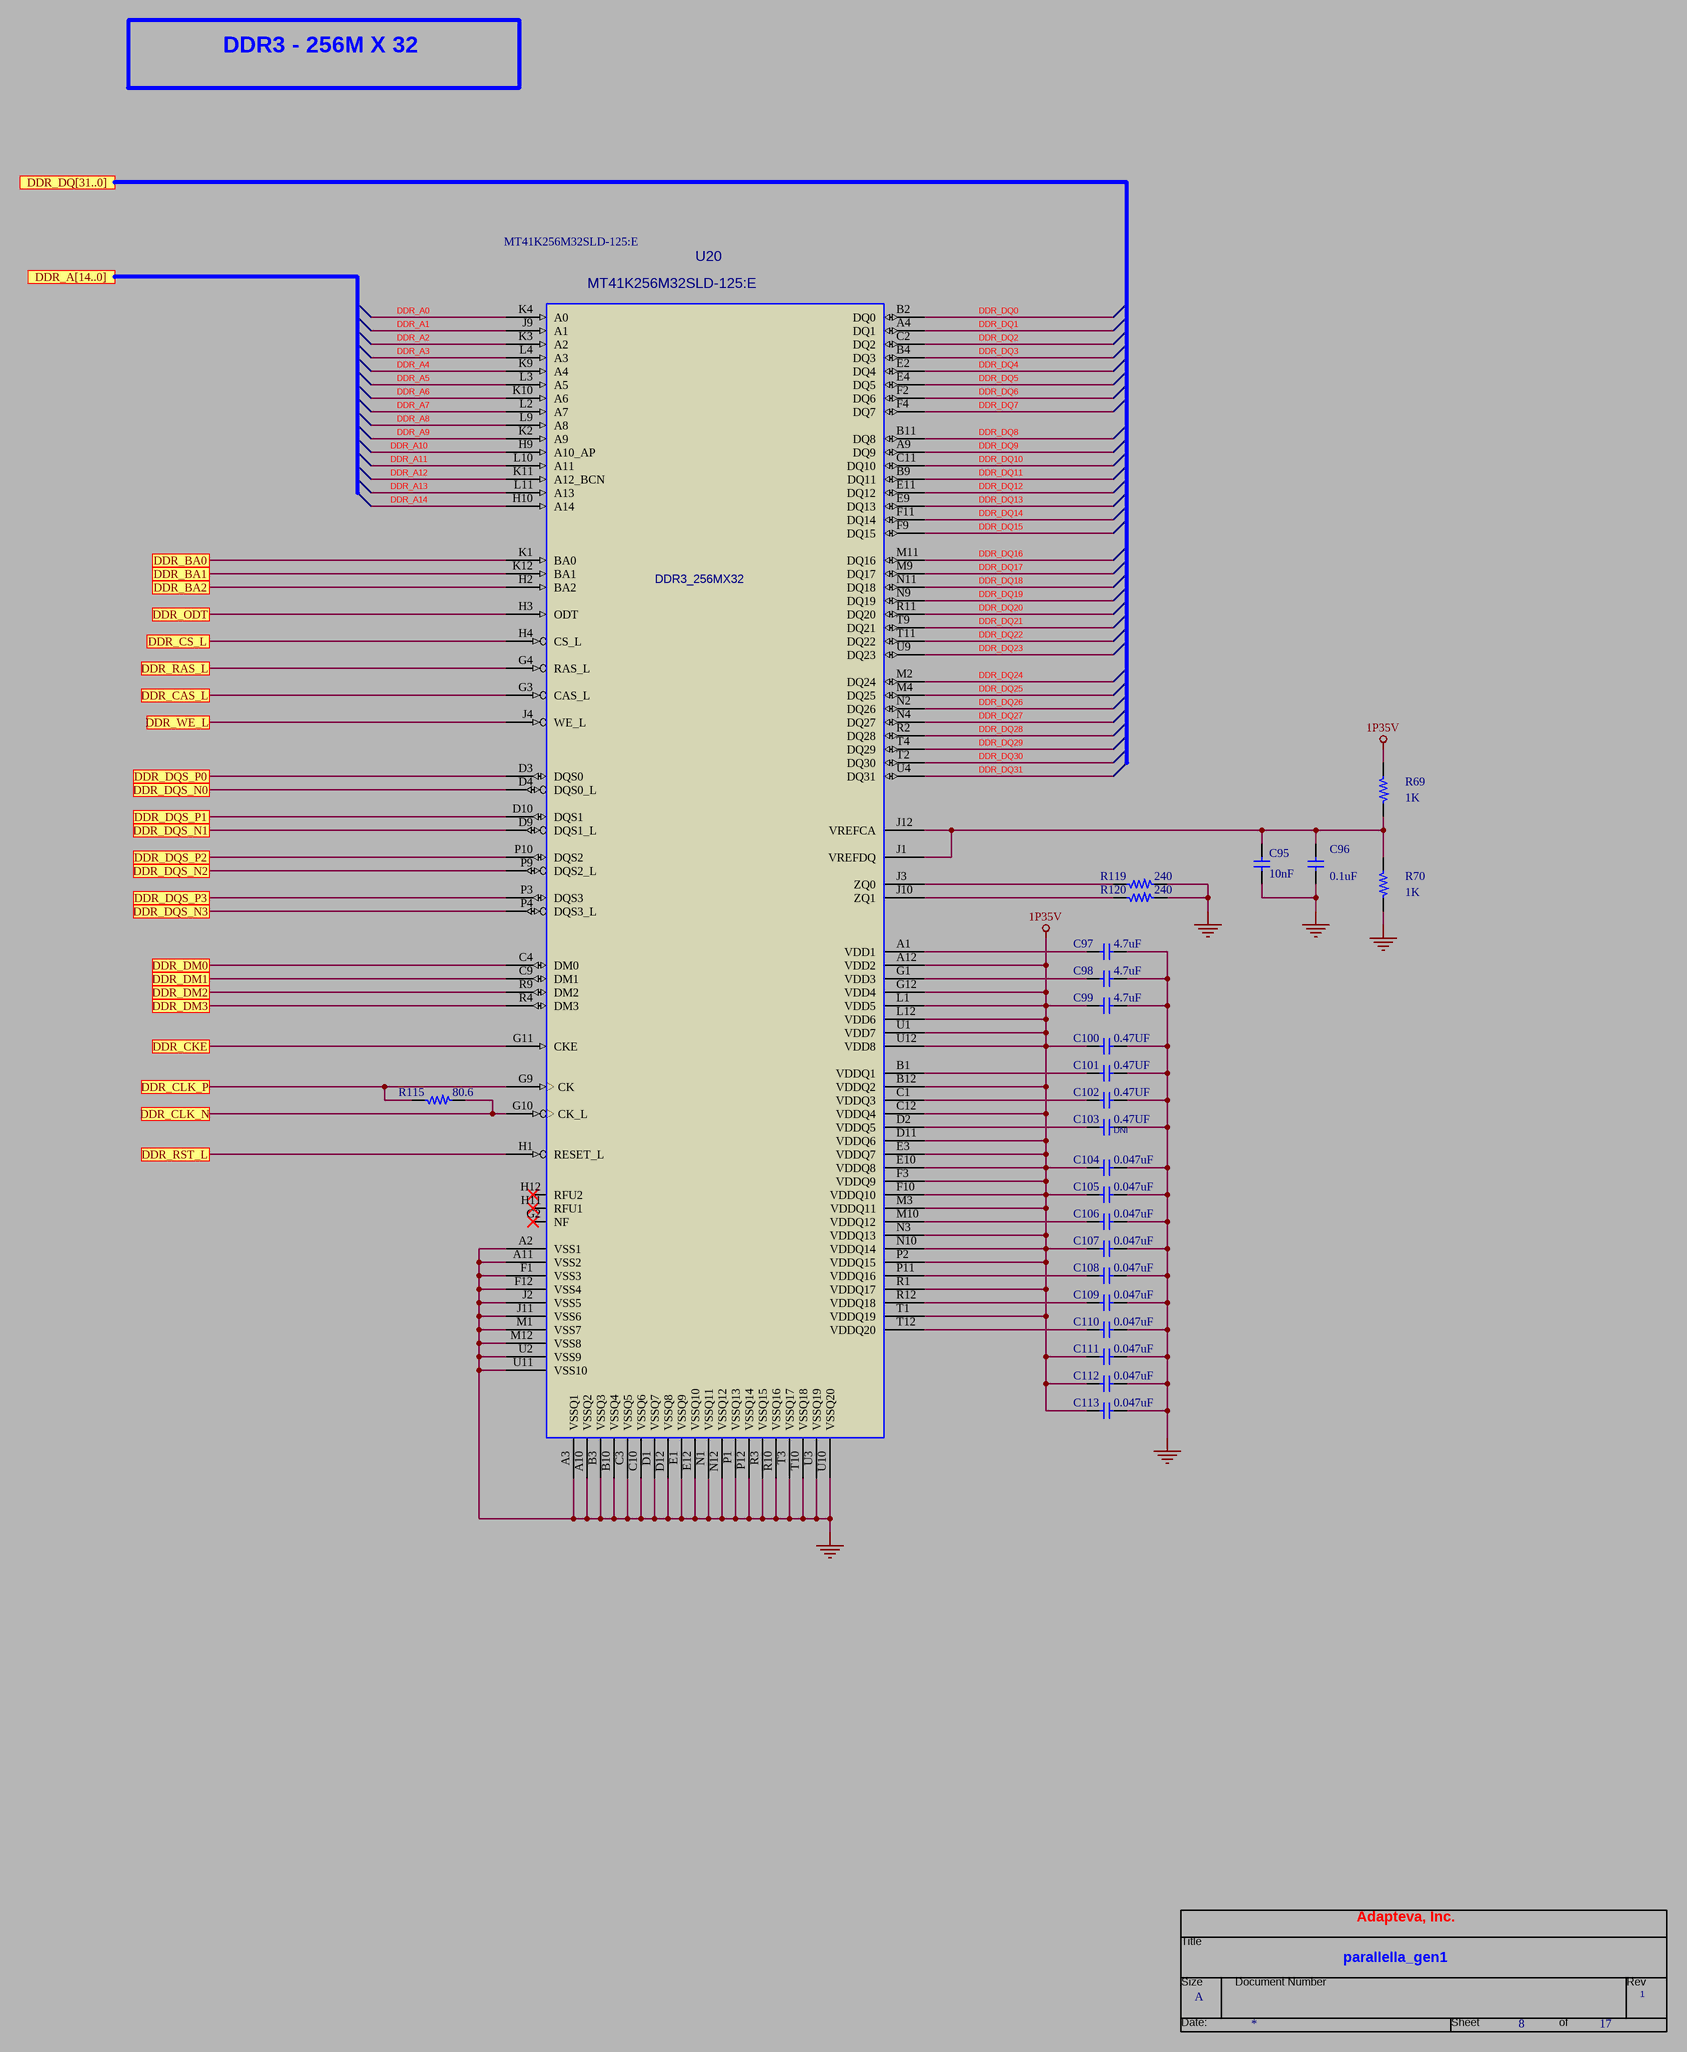
[diagram p10: 08-DDR3-256MX32.SchDoc]

### Parts
(Parts that share a designator on the sheet are numbered #1, #2 ... from top to bottom, then left to right.)
*#8  RevCode: 1  Title: parallella_gen1  Page Size: A  Page Number: 8  Page Count: 17  OrgAddr1: Adapteva, Inc.  (hidden comment: TitleBlock0)  (graphical)
C95  10nF  [C0402]
C96  0.1uF  [C0402]
C97  4.7uF  [C0402]
C98  4.7uF  [C0402]
C99  4.7uF  [C0402]
C100  0.47UF  [C0402]
C101  0.47UF  [C0402]
C102  0.47UF  [C0402]
C103  0.47UF  INSTALL: DNI  [C0402]
C104  0.047uF  [C0402]
C105  0.047uF  [C0402]
C106  0.047uF  [C0402]
C107  0.047uF  [C0402]
C108  0.047uF  [C0402]
C109  0.047uF  [C0402]
C110  0.047uF  [C0402]
C111  0.047uF  [C0402]
C112  0.047uF  [C0402]
C113  0.047uF  [C0402]
R69  1K  [R0402]
R70  1K  [R0402]
R115  80.6  [R0402]
R119  240  [R0402]
R120  240  [R0402]
U20  DDR3_256MX32  Vendor PN: MT41K256M32SLD-125:E  [FBGA136_11X14X1P1_P8MMP]

### Ports
DDR_A[14..0], DDR_BA0, DDR_BA1, DDR_BA2, DDR_CAS_L, DDR_CKE, DDR_CLK_N, DDR_CLK_P, DDR_CS_L, DDR_DM0, DDR_DM1, DDR_DM2, DDR_DM3, DDR_DQ[31..0], DDR_DQS_N0, DDR_DQS_N1, DDR_DQS_N2, DDR_DQS_N3, DDR_DQS_P0, DDR_DQS_P1, DDR_DQS_P2, DDR_DQS_P3, DDR_ODT, DDR_RAS_L, DDR_RST_L, DDR_WE_L

### Nets
1P35V: C99.1 C100.1 C104.1 C105.1 C107.1 C111.1 C112.1 C113.1 R69.1 U20.A12(VDD2) U20.B12(VDDQ2) U20.C12(VDDQ4) U20.D11(VDDQ6) U20.E3(VDDQ7) U20.E10(VDDQ8) U20.F3(VDDQ9) U20.F10(VDDQ10) U20.G12(VDD4) U20.L1(VDD5) U20.L12(VDD6) U20.M3(VDDQ11) U20.N3(VDDQ13) U20.N10(VDDQ14) U20.P2(VDDQ15) U20.R1(VDDQ17) U20.T1(VDDQ19) U20.U1(VDD7) U20.U12(VDD8)
GND: C95.2 C96.1 C97.2 C98.2 C99.2 C100.2 C101.2 C102.2 C103.2 C104.2 C105.2 C106.2 C107.2 C108.2 C109.2 C110.2 C111.2 C112.2 C113.2 R70.2 R119.2 R120.2 U20.A2(VSS1) U20.A3(VSSQ1) U20.A10(VSSQ2) U20.A11(VSS2) U20.B3(VSSQ3) U20.B10(VSSQ4) U20.C3(VSSQ5) U20.C10(VSSQ6) U20.D1(VSSQ7) U20.D12(VSSQ8) U20.E1(VSSQ9) U20.E12(VSSQ10) U20.F1(VSS3) U20.F12(VSS4) U20.J2(VSS5) U20.J11(VSS6) U20.M1(VSS7) U20.M12(VSS8) U20.N1(VSSQ11) U20.N12(VSSQ12) U20.P1(VSSQ13) U20.P12(VSSQ14) U20.R3(VSSQ15) U20.R10(VSSQ16) U20.T3(VSSQ17) U20.T10(VSSQ18) U20.U2(VSS9) U20.U3(VSSQ19) U20.U10(VSSQ20) U20.U11(VSS10)  [project net PHY_DIS_REG10]
DDR_A0: U20.K4(A0)
DDR_A1: U20.J9(A1)
DDR_A2: U20.K3(A2)
DDR_A3: U20.L4(A3)
DDR_A4: U20.K9(A4)
DDR_A5: U20.L3(A5)
DDR_A6: U20.K10(A6)
DDR_A7: U20.L2(A7)
DDR_A8: U20.L9(A8)
DDR_A9: U20.K2(A9)
DDR_A10: U20.H9(A10_AP)
DDR_A11: U20.L10(A11)
DDR_A12: U20.K11(A12_BCN)
DDR_A13: U20.L11(A13)
DDR_A14: U20.H10(A14)
DDR_DQ0: U20.B2(DQ0)
DDR_DQ1: U20.A4(DQ1)
DDR_DQ2: U20.C2(DQ2)
DDR_DQ3: U20.B4(DQ3)
DDR_DQ4: U20.E2(DQ4)
DDR_DQ5: U20.E4(DQ5)
DDR_DQ6: U20.F2(DQ6)
DDR_DQ7: U20.F4(DQ7)
DDR_DQ8: U20.B11(DQ8)
DDR_DQ9: U20.A9(DQ9)
DDR_DQ10: U20.C11(DQ10)
DDR_DQ11: U20.B9(DQ11)
DDR_DQ12: U20.E11(DQ12)
DDR_DQ13: U20.E9(DQ13)
DDR_DQ14: U20.F11(DQ14)
DDR_DQ15: U20.F9(DQ15)
DDR_DQ16: U20.M11(DQ16)
DDR_DQ17: U20.M9(DQ17)
DDR_DQ18: U20.N11(DQ18)
DDR_DQ19: U20.N9(DQ19)
DDR_DQ20: U20.R11(DQ20)
DDR_DQ21: U20.T9(DQ21)
DDR_DQ22: U20.T11(DQ22)
DDR_DQ23: U20.U9(DQ23)
DDR_DQ24: U20.M2(DQ24)
DDR_DQ25: U20.M4(DQ25)
DDR_DQ26: U20.N2(DQ26)
DDR_DQ27: U20.N4(DQ27)
DDR_DQ28: U20.R2(DQ28)
DDR_DQ29: U20.T4(DQ29)
DDR_DQ30: U20.T2(DQ30)
DDR_DQ31: U20.U4(DQ31)
NetC95_1: C95.1 C96.2 R69.2 R70.1 U20.J1(VREFDQ) U20.J12(VREFCA)
NetC97_1: C97.1 U20.A1(VDD1)
NetC98_1: C98.1 U20.G1(VDD3)
NetC101_1: C101.1 U20.B1(VDDQ1)
NetC102_1: C102.1 U20.C1(VDDQ3)
NetC103_1: C103.1 U20.D2(VDDQ5)
NetC106_1: C106.1 U20.M10(VDDQ12)
NetC108_1: C108.1 U20.P11(VDDQ16)
NetC109_1: C109.1 U20.R12(VDDQ18)
NetC110_1: C110.1 U20.T12(VDDQ20)
NetR111_1: U20.H1(RESET_L) ; port DDR_RST_L
NetR115_1: R115.1 U20.G9(CK) ; port DDR_CLK_P
NetR115_2: R115.2 U20.G10(CK_L) ; port DDR_CLK_N
NetR119_1: R119.1 U20.J3(ZQ0)
NetR120_1: R120.1 U20.J10(ZQ1)
NetR317_2: U20.H2(BA2) ; port DDR_BA2
NetR318_2: U20.K12(BA1) ; port DDR_BA1
NetR319_2: U20.K1(BA0) ; port DDR_BA0
NetR320_2: U20.H3(ODT) ; port DDR_ODT
NetR321_2: U20.H4(CS_L) ; port DDR_CS_L
NetR322_2: U20.J4(WE_L) ; port DDR_WE_L
NetR323_2: U20.G3(CAS_L) ; port DDR_CAS_L
NetR324_2: U20.G4(RAS_L) ; port DDR_RAS_L
NetR325_2: U20.G11(CKE) ; port DDR_CKE
NetU2_A1: U20.C4(DM0) ; port DDR_DM0
NetU2_B2: U20.D4(DQS0_L) ; port DDR_DQS_N0
NetU2_C2: U20.D3(DQS0) ; port DDR_DQS_P0
NetU2_F1: U20.C9(DM1) ; port DDR_DM1
NetU2_F2: U20.D9(DQS1_L) ; port DDR_DQS_N1
NetU2_G2: U20.D10(DQS1) ; port DDR_DQS_P1
NetU2_R2: U20.P10(DQS2) ; port DDR_DQS_P2
NetU2_T1: U20.R9(DM2) ; port DDR_DM2
NetU2_T2: U20.P9(DQS2_L) ; port DDR_DQS_N2
NetU2_W4: U20.P4(DQS3_L) ; port DDR_DQS_N3
NetU2_W5: U20.P3(DQS3) ; port DDR_DQS_P3
NetU2_Y1: U20.R4(DM3) ; port DDR_DM3

Not connected (* = marked no-connect by the designer): U20 G2(NF)* H11(RFU1)* H12(RFU2)*

### Notes on the sheet
- DDR3 - 256M X 32
- (in symbol TitleBlock0) Title; Size; Document Number; Rev; Date:; Sheet; of

### Library data of the parts
C95 = CAP0402_10NF_X7R_16V: as C23 on sheet 04-ZYNQ BANK 501; Vendor: TDK; Vendor PN: C1005X7R1C103K; PCB Footprint: C0402
C96 = CAP0402_0P1UF_X5R_35V: as C9 on sheet 02-ZYNQ BANK 0; DEVICE: CAP0402_0P1UF_X5R_35V; MFG PART NO: GMK105BJ104KV-F; MFG: TAIYO YUDEN; PCB Footprint: C0402
C97-C99 = CAP0402_4P7UF_X5R: as C13 on sheet 03-ZYNQ BANK 500; DEVICE: CAP0402_4P7UF_X5R; Vendor: TDK; Vendor PN: C1005X5R0J475K; PCB Footprint: C0402
C100-C103 = CAP0402_0P47UF_X5R: as C14 on sheet 03-ZYNQ BANK 500; DEVICE: CAP0402_0P47UF_X5R; Vendor: TDK; Vendor PN: C1005X5R1C474K; PCB Footprint: C0402
C104-C113 = CAP0402_0P047UF_X5R: CAP, 0402, 0.047UF, X5R, 25V; MFG PART NO: C1005X5R1E473M; MFG: TDK; DEVICE: CAP0402_0P047UF_X5R; Vendor: TDK; Vendor PN: C1005X5R1E473M; PCB Footprint: C0402
R69 R70 = RES0402_1K: as R11 on sheet 02-ZYNQ BANK 0; DEVICE: RES0402_1K; Vendor PN: CRCW04021K00FKED; PCB Footprint: R0402
R115 = RES0402_80P6: as R112 on sheet 07-ZYNQ BANK 502; DEVICE: RES0402_80P6; Vendor PN: CRCW040280R6FKED; PCB Footprint: R0402
R119 R120 = RES0402_240: as R3 on sheet 02-ZYNQ BANK 0; DEVICE: RES0402_240; Vendor PN: CRCW0402240RFKED; PCB Footprint: R0402
U20 = DDR3_256MX32: IC, DDR3, 8Gb, 256M32, BGA136; Vendor: MICRON; DEVICE: DDR3_256MX32; Supplier 1: Avnet; Supplier Part Number 1: MT41K256M32SLD-125:E
*#8 = TitleBlock0: Page Create Date: March  8, 1995; Page Modify Date: *